# EAGLE board max10adc dpdt (EAGLE 8.4.3), part 1 of 2
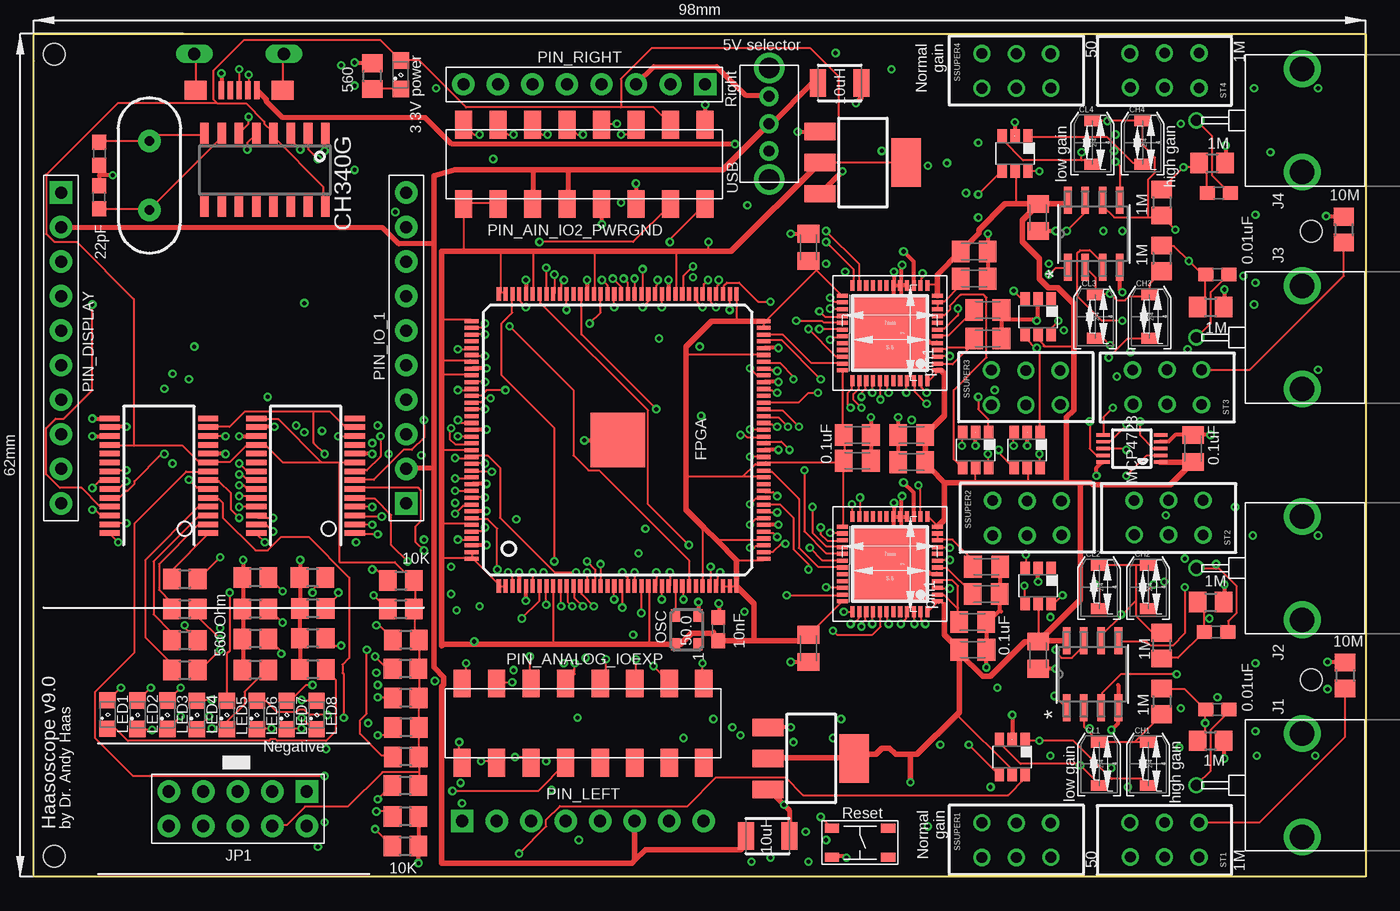
[diagram p2: board, top side]
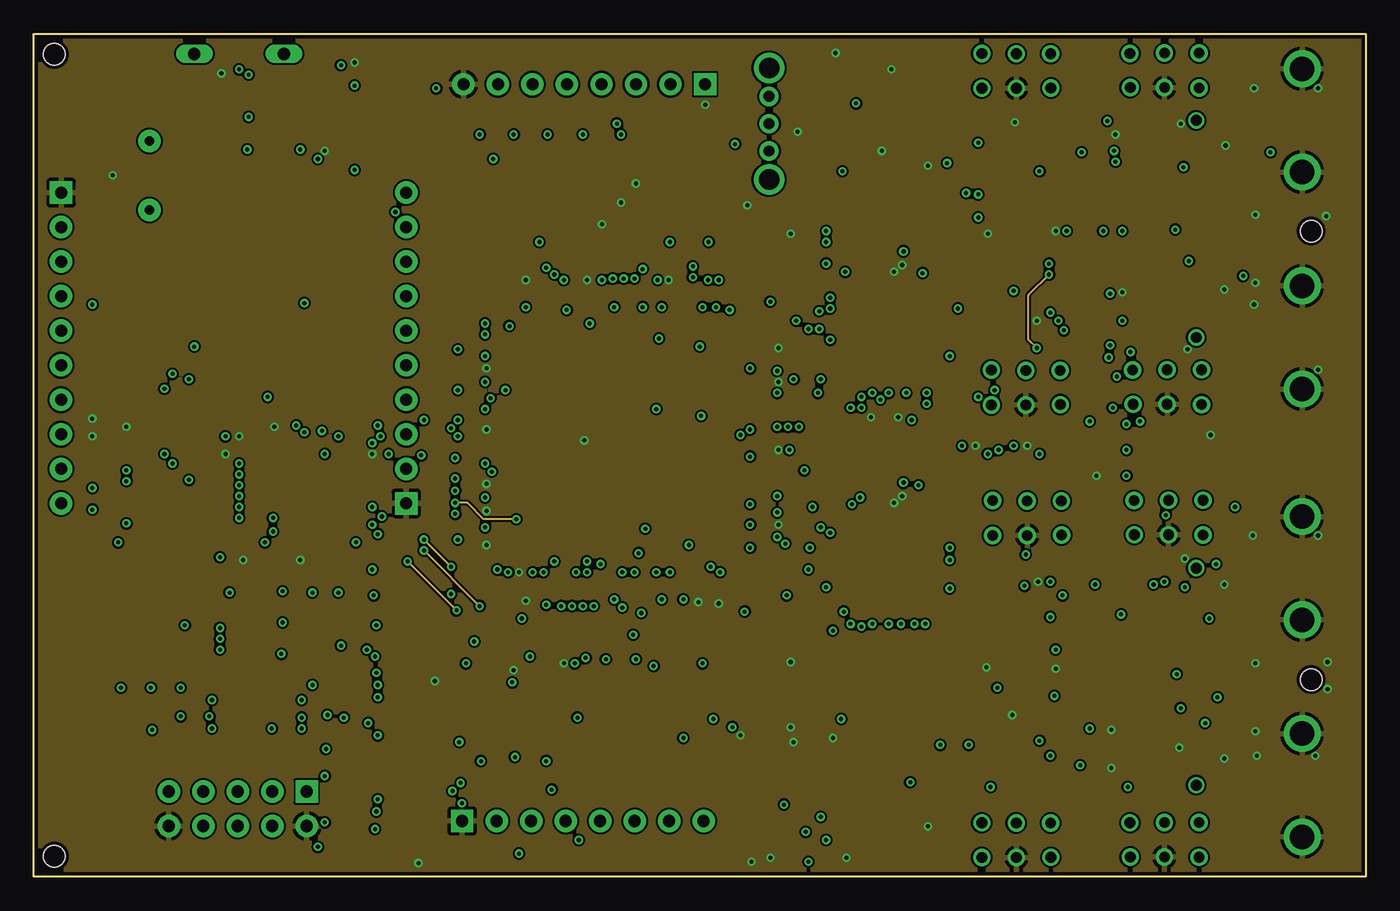
[diagram p3: board, inner layer Route2]
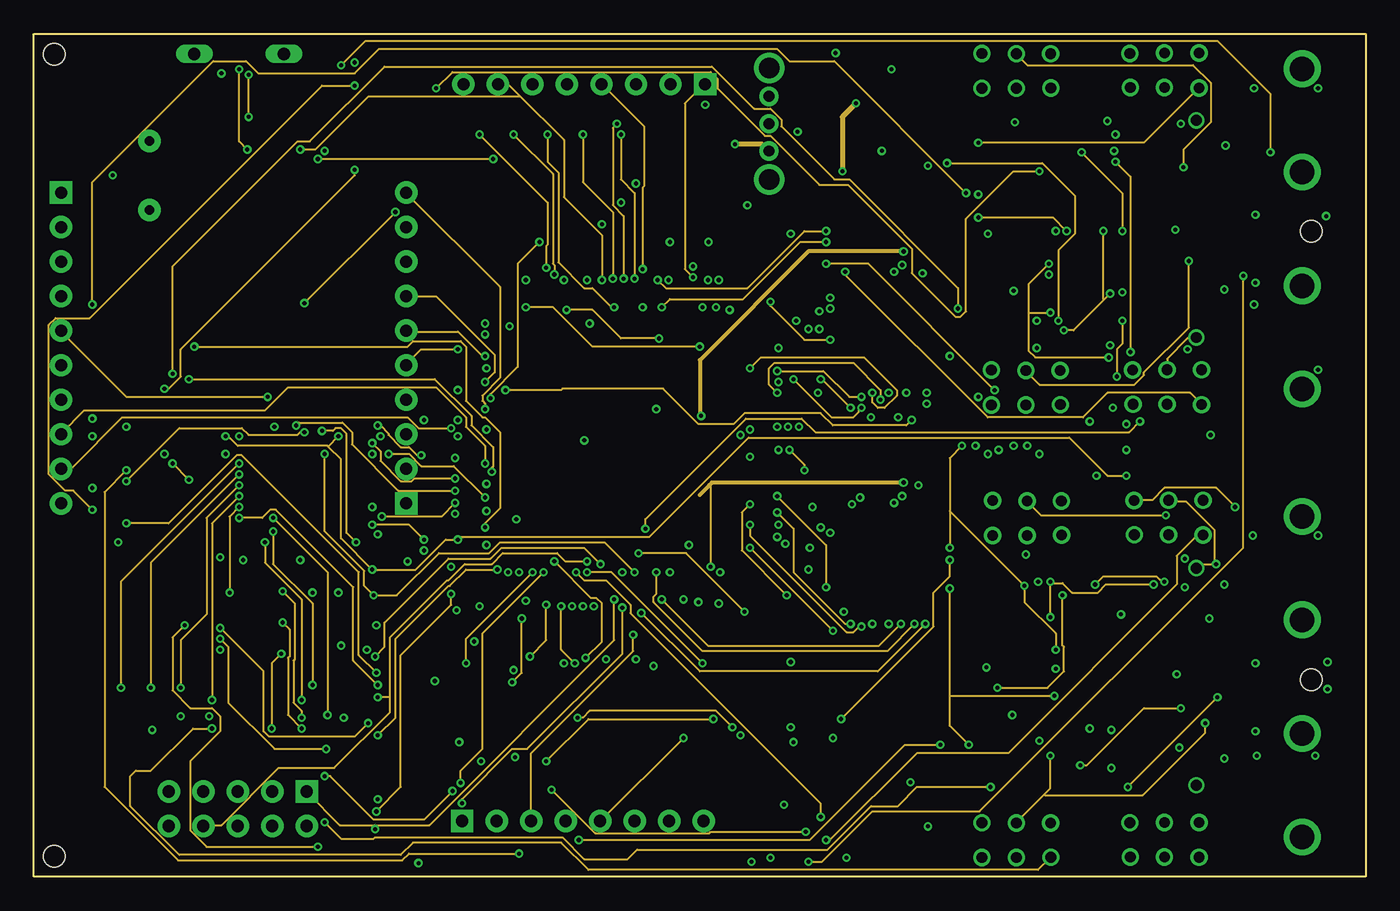
[diagram p4: board, inner layer Route15]
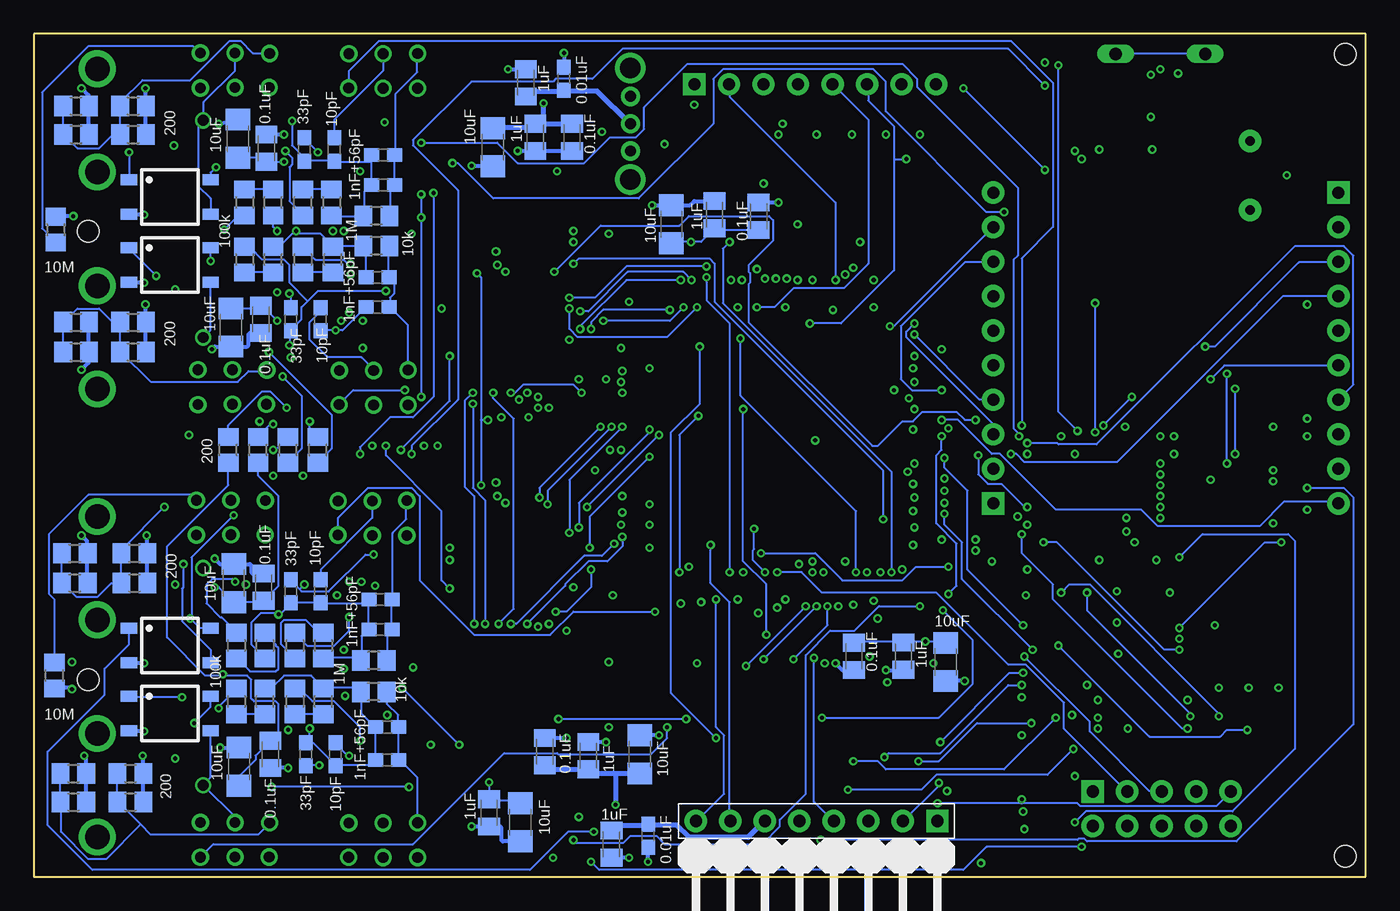
[diagram p5: board, bottom side, seen from below]

Size 98 x 62 mm. Coordinates in mm from the lower left corner, seen from the top.
Outline: 0,0 0,62 98,62 98,0 0,0
Copper layers (1*2*15*16): Top 0.035mm / dielectric 0.2mm / Route2 0.0175mm / dielectric 0.3mm / Route15 0.0175mm / dielectric 0.2mm / Bottom 0.035mm
Design rules "Seeed_AllPCB_MacroFab_haas6mil": minimum track width 6mil, minimum drill 12mil, track to track 6mil, track to pad 6mil, pad to pad 6mil, via to via 6mil, smd to smd 0mil, copper to edge 10mil, drill to drill 8mil, minimum pad ring 6mil, minimum via ring 6mil, stop-mask expansion 6mil, vias tented up to drill 25mil, thermal gap 10mil
Net classes: 0 default: width 0.152 mm; 1 gnd: width 0.305 mm; 2 three: width 0.152 mm; 3 five: width 0.381 mm
Holes 1.6 mm at 94,14.5 94,47.5 1.5,60.5 1.5,1.5

## Footprints (pad centres in the part's own frame; a part is rotated, then mirrored left to right if it is on the bottom)
R0805 = smd 1.3 x 1.5: 1 -0.95,0; 2 0.95,0
C0805K = smd 1.3 x 1.6: 1 -1,0; 2 1,0
C0603 = smd 1.1 x 1: 1 -0.85,0; 2 0.85,0
C1206 = smd 1.6 x 1.8: 1 -1.4,0; 2 1.4,0
CTZ3 = smd 1.2 x 0.8: + 0,1.598; - 0,-1.588
MSOP10 = smd 0.25 x 1: 1 -1,-2.113; 2 -0.5,-2.113; 3 0,-2.113; 4 0.5,-2.113; 5 1,-2.113; 6 1,2.113; 7 0.5,2.113; 8 0,2.113; 9 -0.5,2.113; 10 -1,2.113
EQFP144 = smd 1 x 0.3: 1 -10.75,8.75; 2 -10.75,8.25; 3 -10.75,7.75; 4 -10.75,7.25; 5 -10.75,6.75; 6 -10.75,6.25; 7 -10.75,5.75; 8 -10.75,5.25; 9 -10.75,4.75; 10 -10.75,4.25; 11 -10.75,3.75; 12 -10.75,3.25; 13 -10.75,2.75; 14 -10.75,2.25; 15 -10.75,1.75; 16 -10.75,1.25; 17 -10.75,0.75; 18 -10.75,0.25; 19 -10.75,-0.25; 20 -10.75,-0.75; 21 -10.75,-1.25; 22 -10.75,-1.75; 23 -10.75,-2.25; 24 -10.75,-2.75; 25 -10.75,-3.25; 26 -10.75,-3.75; 27 -10.75,-4.25; 28 -10.75,-4.75; 29 -10.75,-5.25; 30 -10.75,-5.75; 31 -10.75,-6.25; 32 -10.75,-6.75; 33 -10.75,-7.25; 34 -10.75,-7.75; 35 -10.75,-8.25; 36 -10.75,-8.75; 73 10.75,-8.75; 74 10.75,-8.25; 75 10.75,-7.75; 76 10.75,-7.25; 77 10.75,-6.75; 78 10.75,-6.25; 79 10.75,-5.75; 80 10.75,-5.25; 81 10.75,-4.75; 82 10.75,-4.25; 83 10.75,-3.75; 84 10.75,-3.25; 85 10.75,-2.75; 86 10.75,-2.25; 87 10.75,-1.75; 88 10.75,-1.25; 89 10.75,-0.75; 90 10.75,-0.25; 91 10.75,0.25; 92 10.75,0.75; 93 10.75,1.25; 94 10.75,1.75; 95 10.75,2.25; 96 10.75,2.75; 97 10.75,3.25; 98 10.75,3.75; 99 10.75,4.25; 100 10.75,4.75; 101 10.75,5.25; 102 10.75,5.75; 103 10.75,6.25; 104 10.75,6.75; 105 10.75,7.25; 106 10.75,7.75; 107 10.75,8.25; 108 10.75,8.75 | smd 0.3 x 1: 37 -8.75,-10.75; 38 -8.25,-10.75; 39 -7.75,-10.75; 40 -7.25,-10.75; 41 -6.75,-10.75; 42 -6.25,-10.75; 43 -5.75,-10.75; 44 -5.25,-10.75; 45 -4.75,-10.75; 46 -4.25,-10.75; 47 -3.75,-10.75; 48 -3.25,-10.75; 49 -2.75,-10.75; 50 -2.25,-10.75; 51 -1.75,-10.75; 52 -1.25,-10.75; 53 -0.75,-10.75; 54 -0.25,-10.75; 55 0.25,-10.75; 56 0.75,-10.75; 57 1.25,-10.75; 58 1.75,-10.75; 59 2.25,-10.75; 60 2.75,-10.75; 61 3.25,-10.75; 62 3.75,-10.75; 63 4.25,-10.75; 64 4.75,-10.75; 65 5.25,-10.75; 66 5.75,-10.75; 67 6.25,-10.75; 68 6.75,-10.75; 69 7.25,-10.75; 70 7.75,-10.75; 71 8.25,-10.75; 72 8.75,-10.75; 109 8.75,10.75; 110 8.25,10.75; 111 7.75,10.75; 112 7.25,10.75; 113 6.75,10.75; 114 6.25,10.75; 115 5.75,10.75; 116 5.25,10.75; 117 4.75,10.75; 118 4.25,10.75; 119 3.75,10.75; 120 3.25,10.75; 121 2.75,10.75; 122 2.25,10.75; 123 1.75,10.75; 124 1.25,10.75; 125 0.75,10.75; 126 0.25,10.75; 127 -0.25,10.75; 128 -0.75,10.75; 129 -1.25,10.75; 130 -1.75,10.75; 131 -2.25,10.75; 132 -2.75,10.75; 133 -3.25,10.75; 134 -3.75,10.75; 135 -4.25,10.75; 136 -4.75,10.75; 137 -5.25,10.75; 138 -5.75,10.75; 139 -6.25,10.75; 140 -6.75,10.75; 141 -7.25,10.75; 142 -7.75,10.75; 143 -8.25,10.75; 144 -8.75,10.75 | smd 4 x 4: E 0,0
DBV_R-PDSO-G6 = smd 0.69 x 0.99: 1 -0.95,-1.29; 2 0,-1.29; 3 0.95,-1.29; 4 0.95,1.3; 5 0,1.3; 6 -0.95,1.3
TQFP-48 = smd 0.8 x 0.3: 1 -3.5,2.75; 2 -3.5,2.25; 3 -3.5,1.75; 4 -3.5,1.25; 5 -3.5,0.75; 6 -3.5,0.25; 7 -3.5,-0.25; 8 -3.5,-0.75; 9 -3.5,-1.25; 10 -3.5,-1.75; 11 -3.5,-2.25; 12 -3.5,-2.75; 25 3.5,-2.75; 26 3.5,-2.25; 27 3.5,-1.75; 28 3.5,-1.25; 29 3.5,-0.75; 30 3.5,-0.25; 31 3.5,0.25; 32 3.5,0.75; 33 3.5,1.25; 34 3.5,1.75; 35 3.5,2.25; 36 3.5,2.75 | smd 0.3 x 0.8: 13 -2.75,-3.5; 14 -2.25,-3.5; 15 -1.75,-3.5; 16 -1.25,-3.5; 17 -0.75,-3.5; 18 -0.25,-3.5; 19 0.25,-3.5; 20 0.75,-3.5; 21 1.25,-3.5; 22 1.75,-3.5; 23 2.25,-3.5; 24 2.75,-3.5; 37 2.75,3.5; 38 2.25,3.5; 39 1.75,3.5; 40 1.25,3.5; 41 0.75,3.5; 42 0.25,3.5; 43 -0.25,3.5; 44 -0.75,3.5; 45 -1.25,3.5; 46 -1.75,3.5; 47 -2.25,3.5; 48 -2.75,3.5 | smd 5.588 x 5.588: EP_GND 0,0
SSOP28 = smd 0.4 x 1.5: 1 -4.225,-3.625; 2 -3.575,-3.625; 3 -2.925,-3.625; 4 -2.275,-3.625; 5 -1.625,-3.625; 6 -0.975,-3.625; 7 -0.325,-3.625; 8 0.325,-3.625; 9 0.975,-3.625; 10 1.625,-3.625; 11 2.275,-3.625; 12 2.925,-3.625; 13 3.575,-3.625; 14 4.225,-3.625; 15 4.225,3.625; 16 3.575,3.625; 17 2.925,3.625; 18 2.275,3.625; 19 1.625,3.625; 20 0.975,3.625; 21 0.325,3.625; 22 -0.325,3.625; 23 -0.975,3.625; 24 -1.625,3.625; 25 -2.275,3.625; 26 -2.925,3.625; 27 -3.575,3.625; 28 -4.225,3.625
MOLEX-BNC-73100-0105 = drill 1.8: GND1 -3.8,-3.9; GND2 3.8,-3.9 | drill 0.8: SIGNAL 0,3.9
H2X5-2.54 = drill 0.889 pad 1.651 square: 1 -1.27,5.08 | drill 0.889 pad 1.651: 2 -1.27,2.54; 3 -1.27,0; 4 -1.27,-2.54; 5 -1.27,-5.08; 6 1.27,-5.08; 7 1.27,-2.54; 8 1.27,0; 9 1.27,2.54; 10 1.27,5.08
SOP04 = smd 0.8 x 1.2: 1 -1.27,-3; 2 1.27,-3; 3 1.27,3; 4 -1.27,3
1210 = smd 1.2 x 2: 1 -1.6,0; 2 1.6,0
SML0805 = smd 1.2 x 1.2: A 1.05,0; C -1.05,0
ASE = smd 0.9 x 0.65: 1 -1.05,-0.825; 2 1.05,-0.825; 3 1.05,0.825; 4 -1.05,0.825
2X08_SMT = smd 1.27 x 2.032: 1 -8.89,-2.921; 2 -8.89,2.921; 3 -6.35,-2.921; 4 -6.35,2.921; 5 -3.81,-2.921; 6 -3.81,2.921; 7 -1.27,-2.921; 8 -1.27,2.921; 9 1.27,-2.921; 10 1.27,2.921; 11 3.81,-2.921; 12 3.81,2.921; 13 6.35,-2.921; 14 6.35,2.921; 15 8.89,-2.921; 16 8.89,2.921
H10-2.54 = drill 0.889 pad 1.651 square: 1 0,11.43 | drill 0.889 pad 1.651: 2 0,8.89; 3 0,6.35; 4 0,3.81; 5 0,1.27; 6 0,-1.27; 7 0,-3.81; 8 0,-6.35; 9 0,-8.89; 10 0,-11.43
H8-2.54-90D-MALE = drill 0.889 pad 1.651 square: 1 0,8.89 | drill 0.889 pad 1.651: 2 0,6.35; 3 0,3.81; 4 0,1.27; 5 0,-1.27; 6 0,-3.81; 7 0,-6.35; 8 0,-8.89
H8-2.54-90D-FEMALE = drill 0.889 pad 1.651 square: 1 0,8.89 | drill 0.889 pad 1.651: 2 0,6.35; 3 0,3.81; 4 0,1.27; 5 0,-1.27; 6 0,-3.81; 7 0,-6.35; 8 0,-8.89
SOT-223 = smd 1.27 x 2.286: 1 -2.286,-3.175; 2 0,-3.175; 3 2.286,-3.175 | smd 3.556 x 2.159: TER 0,3.175
OS = drill 0.787 pad 1.27: 1 -2.54,1.27; 2 0,1.295; 3 2.54,1.295; 4 -2.515,-1.245; 5 0,-1.245; 6 2.54,-1.27
0S102011MS2QS1 = drill 0.8 pad 1.422: 1 -2.007,0; 2 0,0; 3 2.007,0 | drill 1.5 pad 2.184: P$4 -4.102,0; P$5 4.102,0
TACT4.2MM = smd 1.05 x 0.65: P$1 -2.075,1.075; P$2 2.075,1.075; P$3 -2.075,-1.075; P$4 2.075,-1.075
M08A = smd 1.981 x 0.559: 1 -2.464,1.905; 2 -2.464,0.635; 3 -2.464,-0.635; 4 -2.464,-1.905; 5 2.464,-1.905; 6 2.464,-0.635; 7 2.464,0.635; 8 2.464,1.905
SOIC16 = smd 0.635 x 1.524: 1 -4.445,-2.695; 2 -3.175,-2.695; 3 -1.905,-2.695; 4 -0.635,-2.695; 5 0.635,-2.695; 6 1.905,-2.695; 7 3.175,-2.695; 8 4.445,-2.695; 9 4.445,2.695; 10 3.175,2.695; 11 1.905,2.695; 12 0.635,2.695; 13 -0.635,2.695; 14 -1.905,2.695; 15 -3.175,2.695; 16 -4.445,2.695
10118193-0001LF = smd 0.4 x 1.35: 1 -1.3,2.54; 2 -0.65,2.54; 3 0,2.54; 4 0.65,2.54; 5 1.3,2.54 | drill 0.9 long: S1 -3.3,-0.135; S2 3.3,-0.135 | smd 1.6 x 1.4: S3 -3.2,2.54; S4 3.2,2.54
HC49US = drill 0.7 pad 1.651: 1 -2.54,0; 2 2.54,0

## Placement (x,y rotation side)
ACR1  560  [R0805]  11.1,21.9 0 top
ACR2  560  [R0805]  11.1,19.7 0 top
ACR3  560  [R0805]  11.1,17.4 0 top
ACR4  560  [R0805]  11.1,15.2 0 top
C0DD1_A  0.1uF  [C0805K]  57,16.8 270 top
C0DD2_A  0.1uF  [C0805K]  60.6,30.6 0 top
C0DD2_B  0.1uF  [C0805K]  57,46.3 90 top
C5VOPAMP1  0.1uF  [C0805K]  73.9,16.3 270 top
C5VOPAMP2  0.1uF  [C0805K]  73.9,48.5 270 top
C-AIN1  0.1uF  [C0805K]  69.08,18.74 0 top
C-AIN2  0.1uF  [C0805K]  70.1,22.8 0 top
C-AIN3  0.1uF  [C0805K]  70.2,39.6 0 top
C-AIN4  0.1uF  [C0805K]  69.2,44 0 top
C_5V_10NF  0.01uF  [C0603]  59,58.7 270 bottom
C_5V_10NF1  0.01uF  [C0603]  52.8,3 90 bottom
C_AC1  0.01uF  [C0603]  87.1,12.3 0 top
C_AC2  0.01uF  [C0603]  87,18 0 top
C_AC3  0.01uF  [C0603]  87.1,44.3 0 top
C_AC4  0.01uF  [C0603]  87.2,50.3 0 top
C_OSC  0.01uF  [C0603]  50.36,18.22 90 top
C_OSC1  22pF  [C0603]  4.8,50 90 top
C_OSC2  22pF  [C0603]  4.8,53.2 270 top
CADD1_A  0.1uF  [C0805K]  69.1,16.7 0 top
CADD1_B  0.1uF  [C0805K]  64.6,32.5 180 top
CADD2_A  0.1uF  [C0805K]  64.6,30.5 180 top
CADD2_B  0.1uF  [C0805K]  69.2,46 0 top
CG13  1uF  [C0805K]  34.01,16.23 270 bottom
CG14  10uF  [C1206]  30.91,15.79 270 bottom
CG15  0.1uF  [C0805K]  37.65,16.21 270 bottom
CGAIN1_1  33pF  [C0603]  78,9 270 bottom
CGAIN1_2  33pF  [C0603]  79.1,21 90 bottom
CGAIN1_3  33pF  [C0603]  79.1,41 270 bottom
CGAIN1_4  33pF  [C0603]  78.1,53.5 90 bottom
CH1  3-10pF  [CTZ3]  82,8.3 0 top
CH2  3-10pF  [CTZ3]  82,21.3 0 top
CH3  3-10pF  [CTZ3]  82.1,41.2 0 top
CH4  3-10pF  [CTZ3]  81.6,54 0 top
CIN1NF_1  1nF  [C0603]  72,11 180 bottom
CIN1NF_2  1nF  [C0603]  72.5,18.2 180 bottom
CIN1NF_3  1nF  [C0603]  72.7,44.1 180 bottom
CIN1NF_4  1nF  [C0603]  72.3,50.9 180 bottom
CIN5_1  10pF  [C0603]  75.8,9 90 bottom
CIN5_2  10pF  [C0603]  76.9,21 90 bottom
CIN5_3  10pF  [C0603]  76.9,41 90 bottom
CIN5_4  10pF  [C0603]  75.9,53.5 90 bottom
CIN56_1  56pF  [C0603]  72,8.6 180 bottom
CIN56_2  56pF  [C0603]  72.5,20.4 180 bottom
CIN56_3  56pF  [C0603]  72.7,41.9 180 bottom
CIN56_4  56pF  [C0603]  72.3,53.1 180 bottom
CL1  8-45pF  [CTZ3]  78.4,8.3 0 top
CL2  8-45pF  [CTZ3]  78.4,21.3 0 top
CL3  8-45pF  [CTZ3]  78.1,41.2 0 top
CL4  8-45pF  [CTZ3]  77.9,54 0 top
CODD1_B  0.1uF  [C0805K]  60.6,32.5 0 top
COFFSET  0.1uF  [C0805K]  85.3,31.5 270 top
COFFSETA1  10uF  [C1206]  83.3,21.6 270 bottom
COFFSETA2  10uF  [C1206]  83.5,40.4 90 bottom
COFFSETA3  10uF  [C1206]  83,54.3 270 bottom
COFFSETA6  10uF  [C1206]  82.9,8.1 270 bottom
COFFSETB6  0.1uF  [C0805K]  80.6,9 90 bottom
COFFSETB8  0.1uF  [C0805K]  81.1,21.3 270 bottom
COFFSETB10  0.1uF  [C0805K]  81.3,41 90 bottom
COFFSETB12  0.1uF  [C0805K]  80.9,53.6 270 bottom
CP1  1uF  [C0805K]  61.1,54.4 270 bottom
CP2  0.1uF  [C0805K]  58.4,54.4 270 bottom
CP3  10uF  [C1206]  53.4,9 90 bottom
CP4  10uF  [C1206]  62.2,4 270 bottom
CP5  10uF  [C1206]  64.22,53.67 270 bottom
CP6  10uF  [C1206]  51.08,48 90 bottom
CP7  1uF  [C0805K]  57.2,8.9 90 bottom
CP8  0.1uF  [C0805K]  60.4,9.2 90 bottom
CP9  1uF  [C0805K]  64.5,4.7 270 bottom
CP10  1uF  [C0805K]  55.5,2.4 90 bottom
CP11  1uF  [C0805K]  61.8,58.4 270 bottom
CREF1  0.1uF  [C0805K]  70.08,20.8 0 top
CREF2  0.1uF  [C0805K]  70.2,41.7 0 top
CV11  0.1uF  [C0805K]  44.67,48.59 90 bottom
CV12  1uF  [C0805K]  47.91,48.71 90 bottom
DAC1  MCP4728  [MSOP10]  80.8,31.5 90 top
FPGA  10M08SAE144  [EQFP144]  42.96,32.13 90 top
GAINSW1  741G3157DBVR  [DBV_R-PDSO-G6]  72,8.8 180 top
GAINSW2  741G3157DBVR  [DBV_R-PDSO-G6]  73.9,21.4 180 top
GAINSW3  741G3157DBVR  [DBV_R-PDSO-G6]  73.9,41.2 180 top
GAINSW4  741G3157DBVR  [DBV_R-PDSO-G6]  72.2,53.2 180 top
IC1  MAX19506  [TQFP-48]  63,23 180 top
IC2  MAX19506  [TQFP-48]  63,40 180 top
IOEXPAND_0X20_BOT  MCP23017SS  [SSOP28]  9.2,29.5 90 top
IOEXPAND_0X24_TOP  MCP23017SS  [SSOP28]  20,29.5 90 top
J1  MOLEX_BNC_73100-0105  [MOLEX-BNC-73100-0105]  89.44,6.73 90 top
J2  MOLEX_BNC_73100-0105  [MOLEX-BNC-73100-0105]  89.44,22.7 90 top
J3  MOLEX_BNC_73100-0105  [MOLEX-BNC-73100-0105]  89.44,39.67 90 top
J4  MOLEX_BNC_73100-0105  [MOLEX-BNC-73100-0105]  89.44,55.64 90 top
JP1  2x5p-2.54  [H2X5-2.54]  15,5 270 top
K1  AQY21SOP  [SOP04]  88,12 270 bottom
K2  AQY21SOP  [SOP04]  88,17 270 bottom
K3  AQY21SOP  [SOP04]  88,45 270 bottom
K4  AQY21SOP  [SOP04]  88,50 270 bottom
L1  10uH  [1210]  59.3,58.4 0 top
L2  10uH  [1210]  54,3 0 top
LED1  MF-LED-0805-RED  [SML0805]  5.42,11.93 90 top
LED2  MF-LED-0805-RED  [SML0805]  7.62,11.92 90 top
LED3  MF-LED-0805-RED  [SML0805]  9.82,11.91 90 top
LED4  MF-LED-0805-RED  [SML0805]  12,11.9 90 top
LED5  MF-LED-0805-RED  [SML0805]  14.2,11.9 90 top
LED6  MF-LED-0805-RED  [SML0805]  16.4,11.9 90 top
LED7  MF-LED-0805-RED  [SML0805]  18.6,11.9 90 top
LED8  MF-LED-0805-RED  [SML0805]  20.8,11.9 90 top
LEDPOW  MF-LED-0805-RED  [SML0805]  27,59 90 top
OSC  ASE-50.000MHZ-ET  [ASE]  48.04,18.16 90 top
OVSAMP1  741G3157DBVR  [DBV_R-PDSO-G6]  73.1,31.4 180 top
OVSAMP2  741G3157DBVR  [DBV_R-PDSO-G6]  69.3,31.4 180 top
PIN_AIN_IO2_PWRGND  15-91-2160  [2X08_SMT]  40.5,52.4 180 top
PIN_ANALOG_IOEXP  15-91-2160  [2X08_SMT]  40.4,11.3 0 top
PIN_DISPLAY  YELLOW-10P-2.54  [H10-2.54]  2,38.9 0 top
PIN_IO_1  YELLOW-10P-2.54  [H10-2.54]  27.4,38.9 180 top
PIN_LEFT  8p-2.54-90d  [H8-2.54-90D-MALE]  40.4,4.1 270 bottom
PIN_RIGHT  8p-2.54-90d  [H8-2.54-90D-FEMALE]  40.5,58.3 270 top
R10M_1  10M  [R0805]  96.5,14.8 270 top
R10M_2  10M  [R0805]  96.5,14.8 90 bottom
R10M_3  10M  [R0805]  96.4,47.6 270 top
R10M_4  10M  [R0805]  96.4,47.6 270 bottom
R50-1  200  [R0805]  90.9,5.5 0 bottom
R50-2  200  [R0805]  90.9,7.6 0 bottom
R50-3  200  [R0805]  95.1,7.6 0 bottom
R50-4  200  [R0805]  95.1,5.5 0 bottom
R50-5  200  [R0805]  90.6,21.6 0 bottom
R50-6  200  [R0805]  95,23.8 0 bottom
R50-7  200  [R0805]  90.6,23.8 0 bottom
R50-8  200  [R0805]  95,21.6 0 bottom
R50-9  200  [R0805]  90.7,38.6 0 bottom
R50-10  200  [R0805]  94.9,38.6 0 bottom
R50-11  200  [R0805]  94.9,40.8 0 bottom
R50-12  200  [R0805]  90.7,40.8 0 bottom
R50-13  200  [R0805]  90.7,56.7 0 bottom
R50-14  200  [R0805]  90.7,54.6 0 bottom
R50-15  200  [R0805]  94.9,54.6 0 bottom
R50-16  200  [R0805]  94.9,56.7 0 bottom
R_SCL  10K  [R0805]  27,21.8 0 top
R_SDA  10K  [R0805]  27,19.7 0 top
REG  LDL1117S33R  [SOT-223]  61.01,52.54 270 top
REG1  LDL1117S33R  [SOT-223]  57.2,8.7 270 top
RGAIN1_1  100k  [R0805]  81,12.9 90 bottom
RGAIN1_2  100k  [R0805]  81,17 270 bottom
RGAIN1_3  100k  [R0805]  80.4,45.4 90 bottom
RGAIN1_4  100k  [R0805]  82.5,49.6 270 bottom
RGAIN2_1  1M  [R0805]  76.7,12.9 90 bottom
RGAIN2_2  1M  [R0805]  76.7,17 270 bottom
RGAIN2_3  1M  [R0805]  76,45.4 90 bottom
RGAIN2_4  1M  [R0805]  76.1,49.6 270 bottom
RGAIN3_1  100k  [R0805]  83.1,12.9 270 bottom
RGAIN3_2  100k  [R0805]  83.1,17 270 bottom
RGAIN3_3  100k  [R0805]  82.5,45.4 270 bottom
RGAIN3_4  100k  [R0805]  80.4,49.6 90 bottom
RGAIN4_1  1M  [R0805]  78.8,12.9 270 bottom
RGAIN4_2  1M  [R0805]  78.8,17 270 bottom
RGAIN4_3  1M  [R0805]  78.2,45.4 270 bottom
RGAIN4_4  1M  [R0805]  78.2,49.6 90 bottom
RIN1  1M  [R0805]  83,12.9 270 top
RIN1_10K  10K  [R0805]  73,13.6 180 bottom
RIN2  1M  [R0805]  83,17 90 top
RIN2_10K  10K  [R0805]  73,15.9 180 bottom
RIN3  1M  [R0805]  83,45.5 270 top
RIN3_10K  10K  [R0805]  72.8,46.4 180 bottom
RIN4  1M  [R0805]  83,49.6 270 top
RIN4_10K  10K  [R0805]  72.8,48.6 180 bottom
RIN5  1M  [R0805]  86.6,10 0 top
RIN6  1M  [R0805]  86.6,20.2 0 top
RIN7  1M  [R0805]  86.6,41.9 0 top
RIN8  1M  [R0805]  86.7,52.5 0 top
RJ2  10K  [R0805]  27.33,2.26 0 top
RJ3  10K  [R0805]  27.34,15.3 180 top
RJ4  10K  [R0805]  27.33,6.7 180 top
RJ5  10K  [R0805]  27.36,13.14 180 top
RLED1  560  [R0805]  20.53,15.24 180 top
RLED2  560  [R0805]  20.52,17.54 180 top
RLED3  560  [R0805]  20.51,19.74 180 top
RLED4  560  [R0805]  20.5,22 180 top
RLED5  560  [R0805]  16.3,15.2 180 top
RLED6  560  [R0805]  16.3,17.5 180 top
RLED7  560  [R0805]  16.3,19.7 180 top
RLED8  560  [R0805]  16.3,22 180 top
RLEDPOW  560  [R0805]  24.9,58.9 90 top
ROFFSET1  200  [R0805]  83.7,31.4 90 bottom
ROFFSET2  200  [R0805]  81.5,31.4 90 bottom
ROFFSET3  200  [R0805]  79.3,31.4 90 bottom
ROFFSET4  200  [R0805]  77.1,31.4 90 bottom
RS6  10K  [R0805]  27.34,4.42 180 top
RS7  10K  [R0805]  27.37,10.98 180 top
RS8  10K  [R0805]  27.36,8.82 180 top
RS9  10K  [R0805]  27.37,17.42 180 top
SSUPER1  dpdt  [OS]  72.3,2.7 180 top
SSUPER2  dpdt  [OS]  73.1,26.4 180 top
SSUPER3  dpdt  [OS]  73,36 180 top
SSUPER4  dpdt  [OS]  72.3,59.3 180 top
ST1  dpdt  [OS]  83.2,2.7 0 top
ST2  dpdt  [OS]  83.5,26.4 0 top
ST3  dpdt  [OS]  83.4,36 0 top
ST4  dpdt  [OS]  83.2,59.3 0 top
SW_5V  OS102011MS2QN1  [0S102011MS2QS1]  54.1,55.4 90 top
SW_RESET  MF-SW-TACT-4.2MM  [TACT4.2MM]  60.8,2.5 180 top
U1  MAX4416ESA  [M08A]  77.9,14.9 90 top
U2  MAX4416ESA  [M08A]  78,47.3 90 top
U340G  CH340G  [SOIC16]  17,52 180 top
USB1  MF-CON-MICROUSB-RIGHT  [10118193-0001LF]  15.1,60.4 180 top
Y1  ABL-12.000MHZ-B2  [HC49US]  8.5,51.6 90 top

## Tracks (layer width: path | path; a pad name or v marks a point on that pad's centre or on a via)
5VINFROMRIGHT
  Top 0.381: SW_5V.3 54,57.5 52.35,57.5 50.25,59.6 45.6,59.6 44.4,58.4 PIN_RIGHT.3
5VINFROMUSB  (via drill 0.3)
  Top 0.381: v51.6,53.9 30.75,53.9 28.8,55.85 18.3,55.85 17.1,57.05 17.1,57.2 16.5,57.8 USB1.1
  Route15 0.381: v51.6,53.9 53.55,53.9 54,53.45 SW_5V.1
+3V3  (via drill 0.3)
  Top 0.152: 16.35,33.8 IOEXPAND_0X24_TOP.15 16.5,33.65 18,33.65 21.15,30.5 | 7.35,31.7 10.95,31.7 12.15,30.5 12.75,30.5 IOEXPAND_0X20_BOT.9 12.9,30.5 14.4,30.5 15.6,31.7 16.35,31.7 IOEXPAND_0X24_TOP.18 16.5,31.7 17.1,31.7 18.3,30.5 21.15,30.5 | 7.35,31.7 5.7,31.7 IOEXPAND_0X20_BOT.18 | 21.15,30.5 22.5,30.5 | 22.5,30.5 23.55,30.5 IOEXPAND_0X24_TOP.9 | 28.35,7.7 28.35,8.75 RS8.1 28.35,8.9 28.35,10.85 RS7.1 28.35,11 28.35,13.1 RJ5.1 28.35,13.25 28.35,15.2 RJ3.1 28.35,15.35 28.35,17.3 RS9.1 28.2,17.45 28.05,17.6 28.05,19.7 | 28.35,7.7 28.35,6.8 RJ4.1 | 28.35,7.7 25.65,7.7 23.1,5.15 19.95,5.15 18.6,3.8 17.55,3.8 JP1.9 | 22.5,30.5 22.5,23.15 26.55,23.15 27.9,21.8 R_SCL.2 28.05,21.8 28.05,19.7 | U340G.16 21.3,49.4 21.3,50.75 17.7,54.35 17.7,54.65 U340G.4 17.55,54.8 16.95,55.4 16.95,55.55 15.6,56.9 13.5,56.9 | 43.2,56.6 45.6,56.6 46.8,55.4 PIN_AIN_IO2_PWRGND.3 | 43.2,56.6 31.8,56.6 28.35,60.05 LEDPOW.A 25.5,61.55 15.45,61.55 13.2,59.3 13.2,57.2 13.5,56.9 | IC2.36 59.55,37.25 59.55,32.6 CODD1_B.1 59.7,32.45 59.7,30.65 C0DD2_A.1 59.55,30.5 | 59.55,30.5 59.55,25.85 IC1.25 | 57.6,44.6 57,45.2 C0DD2_B.1 | 57.6,44.6 59.4,42.8 IC2.25 | PIN_AIN_IO2_PWRGND.14 34.05,49.55 31.65,49.55 PIN_AIN_IO2_PWRGND.16 31.65,49.4 31.65,46 | FPGA.34 50.85,21.35 51.15,21.35 FPGA.35 51.3,21.35 51.6,21.35 FPGA.36 | 34.35,42.95 34.65,42.95 FPGA.107 | FPGA.2 34.65,21.35 34.35,21.35 FPGA.1 34.2,21.5 32.25,23.45 | 32.25,23.45 32.25,23.75 FPGA.143 | IC1.36 57.15,17.9 C0DD1_A.1 | 30,26 32.1,26 FPGA.139 | 38.25,17.11 38.25,21.35 FPGA.9 | 30,31.4 32.1,31.4 FPGA.128 | 30,36.95 32.1,36.95 FPGA.117 | 45.3,17.11 45.3,21.35 FPGA.23
  Top 0.152: 30,38 32.1,38 FPGA.115 | FPGA.31 49.2,21.5 49.2,25.55 49.33,25.68 | 30,41 32.1,41 FPGA.109 | FPGA.37 53.7,23.3 51.9,23.3 51.71,23.29 | 36.75,46 36.75,42.95 FPGA.103 | 41.25,46 41.25,42.95 FPGA.94 | 47.25,46 47.25,42.95 FPGA.82 | 51.75,40.88 51.75,42.8 FPGA.73 | FPGA.40 53.7,24.8 50.4,24.8 50.3,24.7 | 48,29.45 52.2,29.45 | 52.2,29.45 53.7,29.45 FPGA.49 | 52.2,29.45 53.1,30.35 53.7,30.35 FPGA.51 53.85,30.5 59.55,30.5 | 48,38.45 53.7,38.45 FPGA.67 | FPGA.72 53.7,40.4 FPGA.71 | 30,23.45 32.1,23.45 FPGA.144 32.25,23.45 | 34.35,46 34.35,42.95 | 34.35,42.95 FPGA.108 | 57.6,44.6 53.85,40.85 FPGA.72 | 59.25,52.55 57.9,52.55 REG.2 | 59.25,52.55 64.05,52.55 REG.TER | v32.4,17.3 32.4,17.11 | 49.65,46 v49.65,46.7 | 43.2,56.6 43.2,58.7 45.45,60.95 57.15,60.95 59.25,58.85 59.25,52.55 | 13.5,56.9 6.15,56.9 0.9,51.65 0.9,47.3 1.5,46.7 3.15,46.7 7.35,42.5 7.35,31.7 | 28.05,19.7 R_SDA.2
  Top 0.406: REG.2 51.3,46 49.65,46 47.25,46 41.25,46 36.75,46 34.35,46 31.65,46 30,46 30,41 30,38 30,36.95 30,31.4 30,26 30,23.45 30,17 30.11,17.11 32.4,17.11 38.25,17.11 45.3,17.11 OSC.4 47.59,17.11 48.39,17.92 49.92,17.92 50,18 50,17.73 C_OSC.1 53,17.37 | 53,17.37 56.57,17.37 C0DD1_A.1 | 53,17.37 53,20.09 FPGA.36 51.71,23.29 50.3,24.7 49.33,25.68 48,27 48,29.45 48,38.45 48,39 49.88,40.88 51.75,40.88 FPGA.72
  Bottom 0.152: CV11.1 44.7,47.6 47.85,47.6 CV12.1 48,47.6 48.9,46.7 v49.65,46.7 51,46.7 CP6.1 | CG14.1 31.05,17.3 v32.4,17.3 33.9,17.3 CG13.1 34.05,17.3 37.65,17.3 CG15.1
+5V
  Top 0.381: L1.1 57.3,58.4 54.3,55.4 SW_5V.2 | 36.75,52 36.75,49.55 PIN_AIN_IO2_PWRGND.12 | 39.3,52 39.3,49.55 PIN_AIN_IO2_PWRGND.10 | 29.44,46.55 26.85,46.55 25.65,47.75 2.1,47.75 PIN_DISPLAY.2 | 29.44,30.05 27.45,30.05 PIN_IO_1.2
  Top 0.406: SW_5V.2 50.7,52 39.3,52 36.75,52 31,52 29.44,51.56 29.44,46.55 29.44,30.05 29.44,15.39 30.16,14.67 30.16,14.13 30,13.97 30,1 44,1 44.21,1.21 | 44.21,1.21 PIN_LEFT.6 | 44.21,1.21 45,2 52,2 52.4,2.4 L2.1
  Bottom 0.381: CP11.2 61.8,57.5 61.5,57.8 59.1,57.8 C_5V_10NF.2 58.95,57.8 56.55,57.8 54.15,55.4 SW_5V.2 | CP10.2 55.5,3.5 55.2,3.8 52.8,3.8 C_5V_10NF1.2 52.65,3.8 50.7,3.8 49.8,2.9 45.45,2.9 44.25,4.1 PIN_LEFT.6
A6  (via drill 0.3)
  Top 0.152: v36.7,22.4 36.7,21.4 FPGA.6 | v31.8,15.7 31.8,14.5 31.6,14.3 PIN_ANALOG_IOEXP.2
  Route15 0.152: v36.7,22.4 31.8,17.5 v31.8,15.7
A7  (via drill 0.3)
  Top 0.152: v35.9,19 37.2,20.3 37.2,21.3 FPGA.7 | v35.2,14.3 34.1,14.3 PIN_ANALOG_IOEXP.4
  Route15 0.152: v35.9,19 35.9,15 v35.2,14.3
A8  (via drill 0.3)
  Top 0.152: v37.7,20 37.7,21.3 FPGA.8 | v36.5,16.2 36.5,14.3 PIN_ANALOG_IOEXP.6
  Route15 0.152: v37.7,20 37.7,17.4 v36.5,16.2
A10  (via drill 0.3)
  Top 0.152: v38.8,19.9 38.8,21.3 FPGA.10 | v39.8,15.7 39.8,14.9 39.2,14.3 PIN_ANALOG_IOEXP.8
  Route15 0.152: v38.8,19.9 38.8,16.7 v39.8,15.7
A11  (via drill 0.3)
  Top 0.152: v39.6,19.9 39.3,20.2 39.3,21.3 FPGA.11 | v42.1,16 42.1,14.7 41.7,14.3 PIN_ANALOG_IOEXP.10
  Bottom 0.152: v39.6,19.9 39.6,18.5 v42.1,16
A12  (via drill 0.3)
  Top 0.152: v40.4,19.9 39.8,20.5 39.8,21.3 FPGA.12 | v44.3,16 44.3,14.3 PIN_ANALOG_IOEXP.12
  Bottom 0.152: v44.3,16 v40.4,19.9
A13  (via drill 0.3)
  Top 0.152: v41.2,19.9 40.3,20.8 40.3,21.3 FPGA.13 | v45.6,15.5 46.8,14.3 PIN_ANALOG_IOEXP.14
  Bottom 0.152: v45.6,15.5 v41.2,19.9
A14  (via drill 0.3)
  Top 0.152: v40.7,22.4 40.7,21.4 FPGA.14 | v49.2,15.7 49.2,14.3 PIN_ANALOG_IOEXP.16
  Route15 0.152: v40.7,22.4 42.5,22.4 v49.2,15.7
AIN1  (via drill 0.3)
  Top 0.152: v34.9,22.4 35.2,22.1 35.2,21.4 FPGA.3 | v46.8,46.7 46.8,46.9 49.3,49.4 PIN_AIN_IO2_PWRGND.2
  Bottom 0.152: v34.9,22.4 34.9,29.8 47.3,42.2 47.3,46.2 v46.8,46.7
CGAIN1  (via drill 0.3)
  Top 0.152: GAINSW1.3 71.1,10 71.1,9.8 72.6,8.3 76.9,8.3 v77,8.2 78.4,6.8 CL1.-
  Route15 0.152: v84.4,12.4 81.7,12.4 77.5,8.2 v77,8.2
  Bottom 0.152: v77,8.2 78,8.2 CGAIN1_1.2 | v84.4,12.4 84.4,12.5 83.1,13.8 RGAIN3_1.1
CGAIN2  (via drill 0.3)
  Top 0.152: GAINSW1.1 73,10 v74,10 76.5,10 79.3,7.2 81.6,7.2 82,6.8 CH1.-
  Bottom 0.152: v74,10 74,11 75.9,12.9 77.5,12.9 78.4,13.8 78.8,13.8 RGAIN4_1.1
CGAIN3  (via drill 0.3)
  Top 0.152: v73,23.7 73,22.7 GAINSW2.3 | CL2.- 78.4,21.2 v78.1,21.5
  Route15 0.152: v83.2,21.7 83,21.7 82.6,22.1 78.7,22.1 v78.1,21.5
  Bottom 0.152: v73,23.7 73.6,23.7 76.3,21 78.3,21 78.45,21.15 | 78.45,21.15 79.1,21.8 CGAIN1_2.2 | 78.45,21.15 v78.1,21.5 | v83.2,21.7 83.4,21.9 84.9,21.9 85.3,21.5 85.3,20.1 84.3,19.1 84.2,19.1 83.1,18 RGAIN3_2.1
CGAIN4  (via drill 0.3)
  Top 0.152: v74.8,21.7 74.8,22.6 GAINSW2.1 | CH2.- 82,21.1 v82.4,21.5
  Route15 0.152: v74.8,19.1 74.8,21.6 | v82.4,21.5 78.9,21.5 78.3,20.9 76.4,20.9 75.7,21.6 74.8,21.6 | 74.8,21.6 v74.8,21.7
  Bottom 0.152: v74.8,19.1 74.8,18.1 75.9,17 77.9,17 78.8,17.9 RGAIN4_2.1
CGAIN5  (via drill 0.3)
  Top 0.152: v72.1,43.1 72.7,42.5 72.9,42.5 GAINSW3.3 | v79.2,39.1 78.7,39.6 CL3.-
  Bottom 0.152: v72.1,43.1 77.1,43.1 77.85,42.35 | 77.85,42.35 78.3,41.9 78.3,41 79.1,40.2 CGAIN1_3.2 79.1,40.1 79.2,40 v79.2,39.1 | 77.85,42.35 79.2,43.7 79.2,45 79.6,45.4 81.2,45.4 82.1,46.3 82.5,46.3 RGAIN3_3.1
CGAIN6  (via drill 0.3)
  Top 0.152: v79.1,38.2 80.5,39.6 CH3.- | v74.8,41.5 74.8,42.4 GAINSW3.1
  Route15 0.152: v79.1,38.2 73.7,38.2 73.2,38.7 73.2,41.5 | 73.2,41.5 73.2,43.6 v74.7,45.1 | 73.2,41.5 v74.8,41.5
  Bottom 0.152: v74.7,45.1 74.9,45.1 75.2,45.4 77.3,45.4 78.2,46.3 RGAIN4_3.1
CGAIN7  (via drill 0.3)
  Top 0.152: 77.1,52.7 77.7,52.7 77.9,52.5 CL4.- | 77.1,52.7 72.8,52.7 71.3,54.2 71.3,54.4 GAINSW4.3 | 77.1,52.7 v77.1,53.3
  Route15 0.152: v80.1,47.5 80.1,50.3 v77.1,53.3
  Bottom 0.152: v77.1,53.3 78.1,54.3 CGAIN1_4.2 | RGAIN3_4.1 80.4,47.8 v80.1,47.5
CGAIN8  (via drill 0.3)
  Top 0.152: 79.75,53.65 80.9,52.5 81.6,52.5 CH4.- | 79.75,53.65 79,54.4 73.2,54.4 GAINSW4.1 | 79.75,53.65 v79.5,53.4
  Bottom 0.152: v79.5,53.4 79,52.9 79,52.4 79.2,52.2 79.2,49.7 78.2,48.7 RGAIN4_4.1
CLKINFROMRIGHT_26  (via drill 0.3)
  Top 0.152: v46.8,22.4 46.8,21.4 FPGA.26
  Route15 0.152: v48.5,44.1 47.9,44.7 47.9,56.9 49.3,58.3 PIN_RIGHT.1
  Bottom 0.152: v46.8,22.4 46.8,40.7 48.5,42.4 v48.5,44.1
CLKOUT_32  (via drill 0.3, 0.35)
  Top 0.152: v49.8,22.8 49.8,21.4 FPGA.32
  Top 0.305: IC1.15 64.75,28.25 v64,29
  Route15 0.152: v49.8,22.8 49.8,28.7 49.7,28.8
  Route15 0.305: 49,28.1 49.7,28.8 49.9,29 v64,29
CLKOUT_33  (via drill 0.3, 0.35)
  Top 0.152: v50.5,22.4 50.3,22.2 50.3,21.4 FPGA.33
  Top 0.305: IC2.15 64.75,45.25 v64,46
  Route15 0.152: v49.1,33.9 49,34
  Route15 0.305: v64,46 57,46 49,38 49,34
  Bottom 0.152: v50.5,22.4 50.5,32.5 v49.1,33.9
CLKOUTTOLEFT_28  (via drill 0.3)
  Top 0.152: v47.8,20.4 47.8,21.3 FPGA.28
  Bottom 0.152: v47.8,20.4 47.8,11 47.2,10.4 47.2,6.1 49.2,4.1 PIN_LEFT.8
CONF  (via drill 0.3)
  Top 0.152: v34.1,22.6 34.1,25.6 33.4,26.3 32.3,26.3 FPGA.138 | v25.3,10.4 25.9,10.4 26.4,10.9 RS7.2
  Route15 0.152: v34.1,22.6 31.8,22.6 30.6,21.4 30.5,21.4 26.6,17.5 26.6,11.7 v25.3,10.4
CONFIG_SEL  (via drill 0.3)
  Top 0.152: v31.2,32.4 32.2,32.4 FPGA.126 | v25.2,4.8 26,4.8 26.3,4.5 RS6.2
  Route15 0.152: v30.7,20.8 30.7,20 27,16.3 27,6.6 v25.2,4.8
  Bottom 0.152: v31.2,32.4 31.2,31.4 31.6,31 31.6,26 30.1,24.5 30.1,21.4 v30.7,20.8
D0A  (via drill 0.3)
  Top 0.152: v58.3,21.3 59.5,21.3 IC1.34 | v54.7,28 54.4,28.3 53.8,28.3 FPGA.47
  Route15 0.152: v58.3,21.3 58.3,24.4 v54.7,28
D0B  (via drill 0.3)
  Top 0.152: v60.8,27.9 60.8,26.5 IC1.23 | v56.3,33.1 55.1,34.3 53.8,34.3 FPGA.59
  Bottom 0.152: v60.8,27.9 60.8,28.6 v56.3,33.1
D0C  (via drill 0.3)
  Top 0.152: v57,40.3 59,38.3 59.5,38.3 IC2.34 | v51.2,41.7 51.2,42.8 FPGA.74
  Bottom 0.152: v57,40.3 57,40.8 56.1,41.7 v51.2,41.7
D0D  (via drill 0.3)
  Top 0.152: v58.3,47.5 60.7,45.1 60.7,43.5 IC2.23 | v45.9,43.9 45.9,43.6 45.8,43.5 45.8,42.9 FPGA.85
  Route15 0.152: v58.3,47.5 56.7,47.5 52.5,43.3 46.5,43.3 v45.9,43.9
D1A  (via drill 0.3)
  Top 0.152: v55.4,20.7 59.5,20.7 IC1.35 | v52.7,27.4 53.1,27.8 53.7,27.8 FPGA.46
  Route15 0.152: v55.4,20.7 52.1,24 52.1,26.8 v52.7,27.4
D1B  (via drill 0.3)
  Top 0.152: v60.2,27.4 60.2,26.5 IC1.24 | v55.5,33.1 54.8,33.8 53.8,33.8 FPGA.58
  Bottom 0.152: v60.2,27.4 60.2,28.4 v55.5,33.1
D1C
  Top 0.152: IC2.35 59.5,37.8 57.2,37.8 55.1,39.9 53.8,39.9 FPGA.70
D1D  (via drill 0.3)
  Top 0.152: v58.3,46.7 60.3,44.7 60.3,43.5 IC2.24 | v46.2,41.9 46.2,42.8 FPGA.84
  Route15 0.152: v58.3,46.7 56.4,46.7 52.2,42.5 46.8,42.5 v46.2,41.9
D2A  (via drill 0.3)
  Top 0.152: v59.6,19.5 IC1.37 | v57,22.6 57,23 55.9,24.1 55.9,26.4 54.9,27.4 53.8,27.4 FPGA.45
  Bottom 0.152: v59.6,19.5 58.8,19.5 57,21.3 v57,22.6
D2B  (via drill 0.3)
  Top 0.152: v58.6,25.3 59.5,25.3 IC1.26 | v54.7,33.1 54.5,33.1 54.3,33.3 53.8,33.3 FPGA.57
  Bottom 0.152: v58.6,25.3 58.6,29.2 v54.7,33.1
D2C  (via drill 0.3)
  Top 0.152: v60.1,34.5 59.9,34.7 59.9,35.6 60.2,35.9 60.2,36.5 IC2.37 | v57.9,36.6 55,39.5 53.9,39.5 53.8,39.4 FPGA.69
  Route15 0.152: v60.1,34.5 58,36.6 v57.9,36.6
D2D  (via drill 0.3)
  Top 0.152: v58.6,42.6 58.9,42.3 59.5,42.3 IC2.26 | v48.5,44.9 47.8,44.2 47.8,42.9 FPGA.81
  Bottom 0.152: v58.6,42.6 56.7,42.6 54.4,44.9 v48.5,44.9
D3A  (via drill 0.3)
  Top 0.152: v60.1,18.6 60.3,18.6 60.7,19 60.7,19.5 IC1.38 | v54.7,26.8 53.8,26.8 FPGA.44
  Route15 0.152: v60.1,18.6 59.7,18.6 55.9,22.4 55.9,25.6 v54.7,26.8
D3B  (via drill 0.3)
  Top 0.152: v57.9,25.7 57.9,25.2 58.4,24.7 59.5,24.7 IC1.27 | v52.7,32.9 53.7,32.9 FPGA.56
  Bottom 0.152: v57.9,25.7 57.9,27.5 52.7,32.7 v52.7,32.9
D3C  (via drill 0.3)
  Top 0.152: v60.9,34.5 60.3,35.1 60.3,35.5 60.7,35.9 60.7,36.5 IC2.38 | v55.9,36.6 55.9,36.8 54.9,37.8 53.8,37.8 FPGA.66
  Route15 0.152: v60.9,34.5 60.7,34.3 60.7,34.2 60.3,33.8 58.7,33.8 v55.9,36.6
D3D  (via drill 0.3)
  Top 0.152: v58.6,41.8 59.5,41.8 IC2.27 | v49.2,41.9 48.8,42.3 48.8,42.8 FPGA.79
  Bottom 0.152: v58.6,41.8 58.6,40.3 58,39.7 51.4,39.7 v49.2,41.9
D4A  (via drill 0.3)
  Top 0.152: v60.9,18.4 60.9,18.6 61.2,18.9 61.2,19.5 IC1.39 | v52.7,25.9 53.1,26.3 53.7,26.3 FPGA.43
  Route15 0.152: v60.9,18.4 60.7,18.4 60.3,18 59.8,18 52.7,25.1 v52.7,25.9
D4B  (via drill 0.3)
  Top 0.152: v57.3,27.2 57.3,25.3 58.3,24.3 59.5,24.3 IC1.28 | v52,32.5 52.3,32.5 52.5,32.3 53.7,32.3 FPGA.55
  Bottom 0.152: v52,32.5 v57.3,27.2
D4C  (via drill 0.3)
  Top 0.152: v60.9,35.3 60.9,35.6 61.2,35.9 61.2,36.5 IC2.39 | v54.7,37.2 54.4,37.2 54.3,37.3 53.8,37.3 FPGA.65
  Route15 0.152: v60.9,35.3 60,35.3 58.1,37.2 v54.7,37.2
D4D  (via drill 0.3)
  Top 0.152: v57.8,41.6 58.2,41.2 59.5,41.2 IC2.28 | v49.6,43.9 49.3,43.6 49.3,42.9 FPGA.78
  Bottom 0.152: v57.8,41.6 57.2,41.6 54.3,44.5 50.2,44.5 v49.6,43.9
D5A  (via drill 0.3)
  Top 0.152: v61.7,18.6 61.7,19.5 IC1.40 | v54.7,25 54.4,25.3 53.8,25.3 FPGA.41
  Bottom 0.152: v61.7,18.6 58.9,21.4 58.9,21.5 57.2,23.2 55.8,23.2 54.7,24.3 v54.7,25
D5B  (via drill 0.3)
  Top 0.152: v56.7,29.9 56.7,25.4 58.3,23.8 59.5,23.8 IC1.29 | v55.6,31.4 55,32 53.9,32 53.8,31.9 FPGA.54
  Route15 0.152: v56.7,29.9 56.7,30.3 v55.6,31.4
D5C  (via drill 0.3)
  Top 0.152: v61.7,35.6 61.7,36.5 IC2.40 | v52.7,37.4 53.2,36.9 53.7,36.9 FPGA.64
  Route15 0.152: v61.7,35.6 61.7,34.9 62.1,34.5 62.6,34.5 63.5,35.4 63.5,35.8 61.1,38.2 53.5,38.2 v52.7,37.4
D5D  (via drill 0.3)
  Top 0.152: v56.1,40.9 58,40.9 58.1,40.8 59.5,40.8 IC2.29 | v50.2,41.9 49.8,42.3 49.8,42.8 FPGA.77
  Bottom 0.152: v56.1,40.9 51.2,40.9 v50.2,41.9
D6A  (via drill 0.3)
  Top 0.152: v58.8,18.1 59.1,17.8 61.7,17.8 62.3,18.4 62.3,19.5 IC1.41 | v52.7,24.2 53,24.2 53.1,24.3 53.7,24.3 FPGA.39
  Route15 0.152: v52.7,24.2 v58.8,18.1
D6B  (via drill 0.3)
  Top 0.152: v57.1,24.2 58,23.3 59.5,23.3 IC1.30 | v52.7,30.9 53.7,30.9 FPGA.52
  Bottom 0.152: v57.1,24.2 57.1,26.5 v52.7,30.9
D6C  (via drill 0.3)
  Top 0.152: v62.3,35.1 62.3,36.5 IC2.41 | v54.7,35.6 54.5,35.6 54.3,35.8 53.8,35.8 FPGA.62
  Route15 0.152: v62.3,35.1 62.3,35.8 60.3,37.8 54.5,37.8 54.1,37.4 54.1,36.2 v54.7,35.6
D6D  (via drill 0.3)
  Top 0.152: v57.8,40.3 59.5,40.3 IC2.30 | v50.4,43.9 50.4,43.6 50.3,43.5 50.3,42.9 FPGA.76
  Bottom 0.152: v57.8,40.3 57.8,40.5 54.4,43.9 v50.4,43.9
D7A  (via drill 0.3)
  Top 0.152: v62.9,18.6 62.8,18.7 62.8,19.5 IC1.42 | v55.3,24.5 55,24.5 54.4,23.9 53.8,23.9 FPGA.38
  Bottom 0.152: v62.9,18.6 62.5,18.6 57.5,23.6 56.2,23.6 v55.3,24.5
D7B
  Top 0.152: IC1.31 59.5,22.8 57.7,22.8 56.3,24.2 56.3,27.8 54.3,29.8 53.8,29.8 FPGA.50
D7C  (via drill 0.3)
  Top 0.152: v62.9,35.6 62.8,35.7 62.8,36.5 IC2.42 | v57.7,35.6 57,35.6 56.3,34.9 53.8,34.9 FPGA.60
  Bottom 0.152: v62.9,35.6 62.6,35.6 62,36.2 58.3,36.2 v57.7,35.6
D7D  (via drill 0.3)
  Top 0.152: v58.6,39.5 58.8,39.7 59.5,39.7 IC2.31 | v54.2,42.3 53.3,42.3 51.9,43.7 51,43.7 50.8,43.5 50.8,42.9 FPGA.75
  Route15 0.152: v58.6,39.5 56.7,39.5 54.2,42 v54.2,42.3
DMINUS  (via drill 0.3)
  Top 0.152: v15.8,59 15.8,57.9 USB1.2 | v15.8,55.9 15.8,55.4 U340G.6
  Route15 0.152: v15.8,55.9 v15.8,59
DPLUS  (via drill 0.3)
  Top 0.152: v15.1,59.4 USB1.3 | v15.7,53.5 15.7,54 16.3,54.6 U340G.5
  Route15 0.152: v15.1,59.4 15.1,54.1 v15.7,53.5
E_20_A6  (via drill 0.3)
  Top 0.152: v6.8,26 5.6,26 IOEXPAND_0X20_BOT.27 | v31.3,9.9 31.3,8.6 31.5,8.4 PIN_ANALOG_IOEXP.1
  Route15 0.152: v6.8,26 9.9,26 14.9,31 15.3,31 23.9,22.4 23.9,16.3 v25.2,15
  Bottom 0.152: v25.2,15 26.2,15 v31.3,9.9
E_20_A7  (via drill 0.3)
  Top 0.152: v6.2,24.6 5.6,25.2 IOEXPAND_0X20_BOT.28 | v32.9,8.5 33.9,8.5 34,8.4 PIN_ANALOG_IOEXP.3
  Route15 0.152: v13.7,18.3 16.9,15.1 16.9,10.7 17.3,10.3 23.6,10.3 v24.6,11.3
  Bottom 0.152: v6.2,24.6 7.4,24.6 v13.7,18.3 | v24.6,11.3 28.6,11.3 31.4,8.5 v32.9,8.5
E_20_B6  (via drill 0.3)
  Top 0.152: v15.1,26.4 14.5,27 14.5,28.2 13.6,29.1 12.9,29.1 IOEXPAND_0X20_BOT.7 | v35.4,8.8 36.1,8.8 36.5,8.4 PIN_ANALOG_IOEXP.5
  Route15 0.152: v15.1,26.4 16.8,26.4 17.4,27 17.8,27 23.5,21.3 23.5,15.9 v25.3,14.1
  Bottom 0.152: v25.3,14.1 26.3,14.1 31.3,9.1 35.1,9.1 v35.4,8.8
E_20_B7  (via drill 0.3)
  Top 0.152: v21.4,7.4 7.3,7.4 4.5,10.2 4.5,13.6 7.4,16.5 7.4,26 11.2,29.8 12.8,29.8 IOEXPAND_0X20_BOT.8 | v30.8,6.3 37.1,6.3 39.1,8.3 PIN_ANALOG_IOEXP.7
  Route15 0.152: v21.4,7.4 21.8,7.4 25,4.2 28.7,4.2 v30.8,6.3
E_ACSW1
  Top 0.152: ACR1.1 10.2,21.9 10.2,22.6 12.8,25.2 IOEXPAND_0X20_BOT.1
E_ACSW2
  Top 0.152: ACR2.1 10.1,19.7 10.1,20.2 9.2,21.1 9.2,23 12.1,25.9 12.8,25.9 IOEXPAND_0X20_BOT.2
E_ACSW3
  Top 0.152: ACR3.1 10.1,17.4 10.1,18 8.8,19.3 8.8,23.2 12.1,26.5 12.8,26.5 IOEXPAND_0X20_BOT.3
E_ACSW4
  Top 0.152: ACR4.1 10.1,15.2 10.1,15.7 8.2,17.6 8.2,23.3 12.1,27.2 12.8,27.2 IOEXPAND_0X20_BOT.4
E_GSW1  (via drill 0.3)
  Top 0.152: v35.7,1.7 37.7,3.7 37.7,4.2 38.7,5.2 48.1,5.2 50.2,7.3 55.3,7.3 56.6,6 71.7,6 72.9,7.2 72.9,7.5 GAINSW1.6 | v6.8,29.9 5.6,29.9 IOEXPAND_0X20_BOT.21
  Route15 0.152: v35.7,1.7 27.6,1.7 27.1,1.2 10.6,1.2 5.2,6.6 5.2,28.3 v6.8,29.9
E_GSW2  (via drill 0.3)
  Top 0.152: GAINSW2.6 75.1,20.1 v75.7,20.7 | v4.3,28.6 4.8,29.1 5.5,29.1 IOEXPAND_0X20_BOT.22
  Route15 0.152: v75.7,20.7 75.7,17 75.8,16.9 75.8,15.1 74.6,13.9 v70.9,13.9 | v66.7,9.7 64.1,9.7 57.1,2.7 v40.1,2.7
  Bottom 0.152: v66.7,9.7 v70.9,13.9 | v40.1,2.7 21.2,2.7 21.1,2.8 20.7,2.8 20.5,2.6 9.5,2.6 0.9,11.2 0.9,27.9 1.6,28.6 v4.3,28.6
E_GSW3  (via drill 0.3)
  Top 0.152: v75.4,40.9 74.9,40.4 74.9,39.9 GAINSW3.6 | v6.8,29.1 6.3,28.6 5.6,28.6 IOEXPAND_0X20_BOT.23
  Route15 0.152: v75.4,40.9 75.4,46.1 76.6,47.3 76.6,50.1 74.2,52.5 v67.2,52.5 | v19.9,42.2 v26.6,48.9 | v19.9,32.7 19.6,32.7 19.4,32.5 15.8,32.5 15.3,33 10.7,33 v6.8,29.1
  Bottom 0.152: v67.2,52.5 66.8,52.5 64.2,49.9 53.5,49.9 48,55.4 48,58.7 47.3,59.4 36.2,59.4 35.3,58.5 35.3,56.3 27.9,48.9 v26.6,48.9 | v19.9,32.7 v19.9,42.2
E_GSW4  (via drill 0.3)
  Top 0.152: v74,51.9 GAINSW4.6 | v9.6,31.1 9.4,31.1 7.4,29.1 7.4,28.9 6.9,28.4 6.8,28.4 6.2,27.8 5.6,27.8 IOEXPAND_0X20_BOT.24
  Route15 0.152: v74,51.9 72.1,51.9 68.6,48.4 68.6,41.6 68.2,41.2 67.8,41.2 64.6,44.4 64.6,46.2 59.9,50.9 57.8,50.9 54.2,54.5 53.8,54.5 50.3,58 50.3,58.7 49.8,59.2 30.8,59.2 v29.6,58 | v23.6,52 23.6,51.6 10.8,38.8 10.8,36.8 9.9,35.9 v9.6,35.9
  Bottom 0.152: v23.6,52 v29.6,58 | v9.6,31.1 v9.6,35.9
E_OVSAMP1  (via drill 0.3)
  Top 0.152: v74,31.1 74,30.1 OVSAMP1.6 | v4.3,42.1 4.3,35.8 2.2,33.7 1.6,33.7 0.9,33 0.9,29.6 1.9,28.6 3.5,28.6 4.8,27.3 5.5,27.3 IOEXPAND_0X20_BOT.25
  Route15 0.152: v68.6,50.3 58.9,60 55.6,60 54.7,60.9 25.4,60.9 23.6,59.1 16.5,59.1 15.6,60 13.2,60 4.3,51.1 v4.3,42.1
  Bottom 0.152: v74,31.1 74,31.6 71.8,33.8 70.1,33.8 68.6,35.3 v68.6,50.3
E_OVSAMP2  (via drill 0.3)
  Top 0.152: v70.2,31.1 70.2,30.1 OVSAMP2.6 | v4.3,27 4.5,27 4.9,26.6 5.5,26.6 IOEXPAND_0X20_BOT.26
  Route15 0.152: v23.6,58.2 21.2,58.2 4.1,41.1 1.6,41.1 1.1,40.6 1.1,29.6 2.3,28.4 2.9,28.4 v4.3,27
  Bottom 0.152: v70.2,31.1 70.2,31.7 66.8,35.1 66.8,50.5 70.1,53.8 70.1,54.2 65.8,58.5 59.8,58.5 59.6,58.7 56.9,58.7 54.7,60.9 26.3,60.9 v23.6,58.2
E_SHDN1  (via drill 0.3)
  Top 0.152: v67.4,23.3 66.5,23.3 IC1.7 | v22.8,11.7 22.8,14.9 22.7,15 22.7,15.6 23.2,16.1 23.2,22 20.2,25 18.2,25 17.2,24 16.3,24 13.9,26.4 13.9,27.5 13.6,27.8 12.9,27.8 IOEXPAND_0X20_BOT.5
  Route15 0.152: v67.4,23.3 67.4,22.1 66.2,20.9 66.2,18.4 v59.4,11.6 | v50,11.6 40.8,11.6 v37.7,8.5
  Bottom 0.152: v50,11.6 v59.4,11.6 | v37.7,8.5 35.9,8.5 35.3,7.9 26.6,7.9 v22.8,11.7
E_SHDN2  (via drill 0.3)
  Top 0.152: v68,41.8 68,41.3 67,40.3 66.5,40.3 IC2.7 | v11.4,29.2 12,28.6 12.8,28.6 IOEXPAND_0X20_BOT.6
  Route15 0.152: v68,41.8 68,43.3 60,51.3 58.9,51.3 55,55.2 55,55.7 54.2,56.5 53,56.5 49.9,59.6 25.8,59.6 20.3,54.1 19.4,54.1 10.2,44.9 v10.2,37 | v11.4,29.2 v10.2,30.4
  Bottom 0.152: v10.2,30.4 v10.2,37
E_SUPER1  (via drill 0.3)
  Top 0.152: v25.3,25.2 23.7,25.2 IOEXPAND_0X24_TOP.1
  Route15 0.152: v13.1,10.9 11.7,10.9 8.6,7.8 7.5,7.8 7.1,7.4 7.1,5.2 10.7,1.6 27,1.6 27.9,2.5 38.8,2.5 40.8,0.5 73.9,0.5 74.8,1.4 SSUPER1.1
  Bottom 0.152: v25.3,25.2 25.3,23.8 23,21.5 23,20.4 13.5,10.9 v13.1,10.9
E_SUPER2  (via drill 0.3)
  Top 0.152: v24.9,25.9 23.7,25.9 IOEXPAND_0X24_TOP.2
  Route2 0.152: v30.7,22.8 v28.7,24.8
  Route15 0.152: v24.9,25.9 27.6,25.9 v28.7,24.8 | v44.5,23.8 48,23.8 v52.3,19.5
  Bottom 0.152: v30.7,22.8 33.1,22.8 34.1,21.8 38.5,21.8 40.5,23.8 v44.5,23.8 | v52.3,19.5 58.3,19.5 60,17.8 65.6,17.8 69.6,21.8 69.6,28 70.2,28.6 73.4,28.6 75.6,26.4 75.6,25.2 SSUPER2.1
E_SUPER3  (via drill 0.3)
  Top 0.152: v25.6,26.5 23.7,26.5 IOEXPAND_0X24_TOP.3
  Route2 0.152: v31,27.5 31.9,27.5 33.1,26.3 v35.5,26.3
  Route15 0.152: v25.6,26.5 30,26.5 v31,27.5 | v58.3,45.1 61.4,45.1 v70.7,35.8
  Bottom 0.152: v35.5,26.3 35.5,29.9 47.9,42.3 47.9,45.1 48.3,45.5 57.9,45.5 v58.3,45.1 | v70.7,35.8 74.5,35.8 75.5,34.8 SSUPER3.1
E_SUPER4  (via drill 0.3)
  Top 0.152: v24.9,27.2 23.7,27.2 IOEXPAND_0X24_TOP.4
  Route15 0.152: v28.5,31 28.2,31 27.6,31.6 27,31.6 26.1,32.5 26.1,32.6 25.5,33.2 v25.3,33.2
  Bottom 0.152: v24.9,27.2 25.1,27.2 26.8,28.9 27.8,28.9 28.5,29.6 v28.5,31 | v25.3,33.2 25.3,45.5 23,47.8 23,58.4 26.1,61.5 72.6,61.5 74.8,59.3 74.8,58.1 SSUPER4.1
E_TERM1  (via drill 0.3)
  Top 0.152: v27.5,23.2 26.3,24.4 26.3,26.6 25.1,27.8 23.7,27.8 IOEXPAND_0X24_TOP.5
  Route2 0.152: v31.1,19.6 v27.5,23.2
  Route15 0.152: v40,11.7 40.4,11.7 40.9,12.2 50.2,12.2 v51.4,11
  Bottom 0.152: v31.1,19.6 28.9,17.4 28.9,14.2 31.4,11.7 v40,11.7 | v51.4,11 51.4,10.2 52.6,9 59.4,9 59.5,9.1 63.4,9.1 70.1,2.4 84.8,2.4 85.7,1.5 ST1.6
E_TERM2  (via drill 0.3)
  Top 0.152: v28.7,24 28.1,24.6 28.1,25.8 28.5,26.2 28.5,28.4 28.3,28.6 23.7,28.6 IOEXPAND_0X24_TOP.6
  Route2 0.152: v32.8,19.9 v28.7,24
  Route15 0.152: v58.3,2.7 58.6,2.7 65,9.1 71.7,9.1 84.1,21.5 84.1,23.6 85.6,25.1 86,25.1 ST2.6
  Bottom 0.152: v32.8,19.9 35.8,19.9 37.6,18.1 39.4,18.1 41.2,16.3 41.2,6.1 43.1,4.2 43.1,3.7 44.4,2.4 51.6,2.4 52.2,3 54.1,3 54.6,2.5 58.1,2.5 v58.3,2.7
E_TERM3  (via drill 0.3)
  Top 0.152: v28.7,33.6 28.7,32.3 27.8,31.4 27.2,31.4 25,29.2 23.7,29.2 IOEXPAND_0X24_TOP.7
  Route15 0.152: v59.7,44.5 59.7,44.3 70.2,33.8 77.2,33.8 79,35.6 85.1,35.6 85.9,34.8 ST3.6
  Bottom 0.152: v28.7,33.6 29.5,33.6 30.1,34.2 32.6,34.2 33.3,33.5 34.1,33.5 35.9,31.7 36.3,31.7 45.4,40.8 45.4,43.6 45.3,43.7 45.3,44.4 45.4,44.5 45.4,45 43.6,46.8 43.6,48.3 43.9,48.6 49.8,48.6 50.5,47.9 56.3,47.9 v59.7,44.5
E_TERM4  (via drill 0.3)
  Top 0.152: v25.5,32.4 25.5,30.9 24.5,29.9 23.7,29.9 IOEXPAND_0X24_TOP.8
  Route15 0.152: v69.5,54 81.7,54 85.7,58 ST4.6
  Bottom 0.152: v25.5,32.4 25.5,32.6 25.9,33 25.9,45.4 25.6,45.7 25.6,50.7 33,58.1 33,58.7 34.1,59.8 49.9,59.8 53.1,56.6 53.1,55 53.7,54.4 55.6,54.4 57.5,52.5 62.4,52.5 63.9,54 v69.5,54
GND  (via drill 0.3)
  Top 0.305: RLED5.2 15.4,15.2 15.4,17.5 RLED6.2 15.4,17.6 15.4,19.6 RLED7.2 15.4,19.7 15.4,22 RLED8.2 15.4,22.1 v15.4,23.3 | RLED1.2 19.6,15.3 19.6,17.5 RLED2.2 19.6,17.6 19.6,19.6 RLED3.2 19.6,19.8 19.6,22 RLED4.2 19.6,22.1 v19.6,23.3 | C-AIN3.2 CREF2.2 71.3,41 73.6,41 v73.8,40.9 73.75,40.95 | C-AIN2.2 71.1,20.8 CREF1.2 71.1,20.7 71.1,19.6 | C-AIN4.2 CADD2_B.2 v70.2,47.3 | CADD2_A.2 CADD1_B.2 v63.6,33.8 | DAC1.4 83.5,32 84,32.5 COFFSET.1 v86.6,32.5 | C0DD2_A.2 CODD1_B.2 v61.6,33.8 | RS6.1 28.3,4.4 28.3,2.3 RJ2.2 28.3,2.2 v28.3,1 | C_OSC2.2 4.8,51.6 | 4.8,51.6 C_OSC1.2 | v63.3,27.5 63.3,26.5 IC1.18 | 63.8,26.5 63.8,27.9 v63.9,28 | 63.8,26.5 IC1.17 | 63.8,26.5 IC1.16 | v63.3,44.5 63.3,43.5 IC2.18 | 63.8,43.5 63.8,44.9 v63.9,45 | 63.8,43.5 IC2.17 63.8,43.4 63.8,42.1 63.9,42 63.9,40.1 63.8,40 IC2.EP_GND | 63.8,43.5 IC2.16 IC2.18 | v48.9,20.2 48.9,19.3 OSC.2 | v72,11.9 GAINSW1.2 | v73.9,21.7 GAINSW2.2 | v69.3,31.7 OVSAMP2.2 | v73.1,31.7 OVSAMP1.2 | GAINSW3.2 73.9,41.1 73.75,40.95 | 73.7,40.9 73.75,40.95 | v72.2,55.5 GAINSW4.2 | v33.3,24.4 32.3,24.4 FPGA.142 | v35.7,22.4 35.7,21.4 FPGA.4 | v36.2,20.3 36.2,21.3 FPGA.5 | v33.3,26.9 32.3,26.9 FPGA.137 | v33.3,28.9 32.3,28.9 FPGA.133 | v33.3,32.9 32.3,32.9 FPGA.125 | v33.3,37.4 32.3,37.4 FPGA.116 | v36.2,43.9 36.2,42.9 FPGA.104 | v54.8,25.9 53.8,25.9 FPGA.42 | v54.8,31.4 53.8,31.4 FPGA.53 | v40.7,43.9 40.7,42.9 FPGA.95 | v54.8,36.4 53.8,36.4 FPGA.63 | v46.7,43.9 46.7,42.9 FPGA.83 | v54.8,38.9 53.8,38.9 FPGA.68 | v78.2,29.5 78.2,30.1 78.6,30.5 DAC1.10 | v50.4,20.1 50.4,19.1 C_OSC.2 | v13.8,59.1 USB1.5 | v4.3,32.4 5.5,32.4 IOEXPAND_0X20_BOT.17 | v6.8,33.1 5.6,33.1 IOEXPAND_0X20_BOT.16
  Top 0.305: v4.3,33.7 5.5,33.7 IOEXPAND_0X20_BOT.15 | v14.1,31.1 12.9,31.1 IOEXPAND_0X20_BOT.10 | v15.1,32.4 16.3,32.4 IOEXPAND_0X24_TOP.17 | v17.7,33.1 16.4,33.1 IOEXPAND_0X24_TOP.16 | v24.9,31.1 23.7,31.1 IOEXPAND_0X24_TOP.10 | v23.6,59.9 24.9,59.9 RLEDPOW.2 | v87.6,8.7 87.6,10 RIN5.2 | v87.6,21.5 87.6,20.2 RIN6.2 | v95.2,15.8 96.5,15.8 R10M_1.1 | v87.6,43.2 87.6,41.9 RIN7.2 | v87.7,53.8 87.7,52.5 RIN8.2 | v95.1,48.6 96.4,48.6 R10M_4.1 | v21.4,53.4 21.4,54.6 U340G.1 | v5.8,51.6 4.8,51.6 | v55.7,15.8 C0DD1_A.2 | v75.2,15.3 C5VOPAMP1.2 | v55.7,47.3 C0DD2_B.2 | v75.2,47.5 C5VOPAMP2.2 | 79.8,14.1 79.8,12.5 U1.4 79.8,12.3 79.8,11.3 v79.3,10.8 | v80.1,43 79.9,43.2 79.9,44.5 U2.4 | v41.8,48 41.8,49.4 PIN_AIN_IO2_PWRGND.8 | v44.3,51 44.3,49.5 PIN_AIN_IO2_PWRGND.6 | v49.4,56.8 49.4,55.4 PIN_AIN_IO2_PWRGND.1 | 71.2,19.5 71.1,19.6 | v55.7,11 54.1,11 REG1.1 | v56.2,54.8 57.8,54.8 REG.1 | v70.1,15.4 CADD1_A.2 70.1,18.7 C-AIN1.2 70.2,18.7 71.1,19.6 | v40.5,32.1 42.9,32.1 FPGA.E | IC1.EP_GND 63.8,23 63.9,23.1 63.9,25 63.8,25.1 63.8,26.4 IC1.17 | IC2.5 66.45,39.3 65.97,39.3 65.27,40 IC2.EP_GND | IC2.18 63.25,40.25 IC2.EP_GND | IC1.18 63.25,23.25 IC1.EP_GND | IC1.18 IC1.17 | IC1.5 66.45,22.3 65.97,22.3 65.27,23 IC1.EP_GND | v59.8,1.4 59.7,1.5 58.8,1.5 SW_RESET.P$2
  Bottom 0.305: CV12.2 48,49.7 49.4,49.7 49.7,49.4 CP6.2 v52.5,49.4 | COFFSETB10.1 82.1,40 82.2,39.9 82.2,39.1 82.3,39 COFFSETA2.1 84.7,39 v84.9,38.8 | COFFSETB8.1 81.9,22.3 82,22.4 82,22.9 82.1,23 COFFSETA1.1 84.3,23 v84.7,23.4 | CP2.2 CP1.2 v62.4,53.4 | R50-11.2 94,40.8 94,38.6 R50-10.2 94,38.5 94,37.8 v94.5,37.3 | R50-9.2 89.8,38.6 89.8,40.8 R50-12.2 89.8,40.9 v89.8,42.1 | R50-8.2 94.1,21.6 94.1,23.8 R50-6.2 94.1,23.9 94.1,24.7 v94.5,25.1 | R50-5.2 89.7,21.6 89.7,23.8 R50-7.2 89.7,23.9 v89.7,25.1 | R50-15.2 94,54.6 94,56.7 R50-16.2 94,56.8 94,57.5 v94.5,58 | R50-14.2 89.8,54.6 89.8,56.7 R50-13.2 89.8,56.8 v89.8,58 | R50-4.2 94.2,5.5 94.2,7.6 R50-3.2 94.2,7.7 94.2,8.8 v94.3,8.9 | R50-1.2 90,5.5 90,7.6 R50-2.2 90,7.7 v90,8.9 | v52.8,1.1 C_5V_10NF1.1 | v59,60.6 C_5V_10NF.1 | v89.9,10.7 91,10.7 K1.2 | v89.9,15.7 91,15.7 K2.2 | v89.9,43.7 91,43.7 K3.2 | v89.9,48.7 91,48.7 K4.2 | v95.2,13.8 95.3,13.9 96.5,13.9 R10M_2.1 | v95.1,48.6 96.4,48.6 R10M_4.1 | v35.3,15.2 34.1,15.2 CG13.2 | v39,15.7 38.5,15.2 37.7,15.2 CG15.2 | v54.2,1.4 CP10.1 | v55.9,9.9 CP7.2 | v58.8,10.2 CP8.2 | v79.3,8 COFFSETB6.1 | v43.2,49.6 44.6,49.6 CV11.2 | v63.1,59.4 CP11.1 | v79.6,54.6 COFFSETB12.1 | v29.5,14.4 CG14.2 | v52,10.4 CP3.2 | v84.3,9.5 COFFSETA6.1 | v65.8,52.3 64.3,52.3 CP5.2 | v84.4,55.4 COFFSETA3.1 | v65.8,3.7 CP9.2 63.7,3.7 63.6,3.6 63.6,2.7 63.5,2.6 CP4.2
  pour Route2: -3,-1 -3,65 99,65 99,-1
INA1  (via drill 0.3)
  Top 0.152: v67.4,21.2 66.5,21.2 IC1.3 | v68.8,9.7 71,7.5 GAINSW1.4 | v72.1,31.7 72.1,32.6 OVSAMP1.3 | v75.1,13.3 75.9,12.5 U1.1
  Route15 0.152: 67.4,13.3 67.4,11.1 v68.8,9.7 | 67.4,13.3 v67.4,21.2 | 67.4,13.3 v75.1,13.3
  Bottom 0.152: v72.1,31.7 72.1,31 68,26.9 68,21.8 v67.4,21.2
INA2  (via drill 0.3)
  Top 0.152: 73.75,38.85 73,39.6 73,39.9 GAINSW3.4 | 73.75,38.85 74,38.6 74,32.7 OVSAMP1.1 | v74.7,44.3 75.2,44.8 76,44.8 U2.1 | v73.8,38.9 73.75,38.85
  Route2 0.152: v74.7,44.3 73.2,42.8 73.2,39.5 v73.8,38.9
INA12  (via drill 0.3)
  Top 0.152: v67.4,38.3 66.5,38.3 IC2.3 | v71,31.4 71,31.2 72.1,30.1 OVSAMP1.4
  Bottom 0.152: v67.4,38.3 67.4,35 v71,31.4
INA-1
  Top 0.152: 67.95,19.75 68,19.7 68,18.8 C-AIN1.1 | 67.95,19.75 67,20.7 66.5,20.7 IC1.2 | IC1.4 66.5,21.8 67.6,21.8 68,21.4 68,19.8 67.95,19.75
INA-2
  Top 0.152: IC2.2 66.5,37.7 67.6,37.7 69.2,39.3 C-AIN3.1 68.7,38.9 67.2,38.9 67.1,38.8 66.5,38.8 IC2.4
INAMINUS1  (via drill 0.3)
  Top 0.152: 81,9.9 CH1.+ | 81,9.9 CL1.+ | 81,9.9 83,11.9 RIN1.2 | CL1.+ 77.55,10.75 | 77.55,10.75 77.3,11 77.3,12.4 U1.2 | CL1.+ | v77.7,10.9 77.55,10.75
  Bottom 0.152: 72.9,11 72.9,8.6 | 75.8,8.2 73.3,8.2 72.9,8.6 | 72.9,8.6 CIN56_1.2 | 77.7,9.8 77.4,9.8 75.8,8.2 | 77.7,9.8 78,9.8 CGAIN1_1.1 77.7,9.8 | 75.8,8.2 CIN5_1.1 | 72.9,11 73.9,12 73.9,13.6 RIN1_10K.2 74,13.6 74.3,13.9 76.7,13.9 | 72.9,11 CIN1NF_1.2 | 76.7,13.9 77.6,14.8 79.6,14.8 80.5,13.9 81,13.9 RGAIN1_1.2 | 76.7,13.9 RGAIN2_1.2 | 77.7,9.8 v77.7,10.9
INAMINUS2  (via drill 0.3)
  Top 0.152: RIN3.2 83,44.5 82.1,43.6 CH3.+ 82.1,42.7 80.6,42.7 80.3,42.4 79.7,42.4 v79.2,42.9 78.2,42.9 CL3.+ 78.1,44.1 77.4,44.8 U2.2
  Route15 0.152: v75.8,40.2 76.5,40.2 78.75,42.45 | v79.2,42.9 78.75,42.45 | v78.7,47.5 78.7,42.5 78.75,42.45
  Bottom 0.152: CIN1NF_3.2 73.6,44.1 73.6,46.3 73.7,46.4 RIN3_10K.2 76,46.4 | 78.7,47.3 76.9,47.3 76,46.4 | 78.7,47.3 79,47.3 79.9,46.4 80.4,46.4 RGAIN1_3.2 | 76,46.4 RGAIN2_3.2 | CIN5_3.1 76.9,40.2 v75.8,40.2 75.3,40.2 73.6,41.9 CIN56_3.2 | CGAIN1_3.1 79.1,42.8 v79.2,42.9 | v78.7,47.5 78.7,47.3
INB1  (via drill 0.3)
  Top 0.152: v67.4,24.2 66.5,24.2 IC1.9 | v68.3,31.7 68.3,32.6 OVSAMP2.3 | v72.9,21.4 72.9,20.1 GAINSW2.4 | v75.2,16.7 75.2,16.5 75.6,16.1 76.4,16.1 77.2,16.9 77.2,17.3 U1.7
  Route15 0.152: 67.4,26.9 67.4,30.8 v68.3,31.7 | 67.4,26.9 v67.4,24.2 | 67.4,26.9 v72.9,21.4 72.9,20.2 75.2,17.9 v75.2,16.7
INB2  (via drill 0.3)
  Top 0.152: v69.5,35.3 69.5,34.4 70.2,33.7 70.2,32.7 OVSAMP2.1 | v69.5,50.2 71.2,51.9 GAINSW4.4 | v76,47.5 77.3,48.8 77.3,49.7 U2.7
  Route15 0.152: v76,47.5 75,48.5 v69.5,48.5
  Bottom 0.152: v69.5,50.2 v69.5,48.5 v69.5,35.3
INB12
  Top 0.152: IC2.9 66.5,41.3 67,41.3 67.4,41.7 67.4,42 68.2,42.8 69.9,42.8 70.1,42.6 70.1,38.2 67.7,35.8 67.7,30.7 68.3,30.1 OVSAMP2.4
INB-1
  Top 0.152: IC1.11 66.5,24.8 | 66.5,24.8 67.6,24.8 69.1,23.3 C-AIN2.1 | 66.5,24.8 IC1.10
INB-2
  Top 0.152: IC2.10 IC2.11 66.5,42.3 67,42.3 68.2,43.5 C-AIN4.1
INBMINUS1  (via drill 0.3)
  Top 0.152: 81.1,22.9 CH2.+ | 81.1,22.9 CL2.+ | 81.1,22.9 81.1,20.3 | 81.1,20.3 81.1,19.2 82.3,18 83,18 RIN2.2 | 81.1,20.3 80.05,19.25 | 80.05,19.25 78.6,17.8 78.6,17.4 U1.6 | v80,19.3 80.05,19.25
  Bottom 0.152: 73.4,20.1 73.4,20.4 CIN56_2.2 73.4,20.1 | 73.4,20.1 73.4,18.2 | 73.9,16.1 73.9,17.7 73.4,18.2 | 73.9,16.1 73.9,15.9 RIN2_10K.2 73.9,16.1 | 73.4,18.2 CIN1NF_2.2 | 73.9,16.1 76.7,16.1 RGAIN2_2.2 | 80,19.4 79.8,19.4 79.1,20.1 CGAIN1_2.1 79.1,20.2 76.9,20.2 CIN5_2.1 76.9,20.1 73.4,20.1 | 80,19.4 81.3,19.4 82,18.7 82,17.1 81,16.1 RGAIN1_2.2 | 80,19.4 v80,19.3
INBMINUS2  (via drill 0.3)
  Top 0.152: CL4.+ v79,55.6 CH4.+ 81.6,53.8 82.5,52.9 82.5,51.8 82,51.3 82,48.5 | v84,47.6 83,48.6 RIN4.2 83,48.5 82,48.5 | 82,48.5 79.5,48.5 78.7,49.3 78.7,49.7 U2.6
  Bottom 0.152: RGAIN2_4.2 76.1,48.6 RIN4_10K.2 73.7,48.6 73.7,50.4 73.2,50.9 | 73.2,52.6 73.2,53.1 CIN56_4.2 | 73.2,52.6 73.2,50.9 | 78.1,52.7 75.9,52.7 CIN5_4.1 75.9,52.6 73.2,52.6 | 73.2,50.9 CIN1NF_4.2 | v84,47.6 83,48.6 82.5,48.6 RGAIN1_4.2 | 78.1,52.7 78.1,52.9 79,53.8 v79,55.6 | 78.1,52.7 CGAIN1_4.1
INJ1
  Top 0.152: C_AC1.2 87.9,12.3 87.9,12.1 86.6,10.8 86.6,7.8 85.6,6.8 J1.SIGNAL
  Bottom 0.152: K1.3 85,7.3 85.5,6.8 J1.SIGNAL 85.5,6.7 83.2,4.4 ST1.2
INJ2  (via drill 0.3)
  Top 0.152: J2.SIGNAL 87.2,22.7 88.5,21.4 88.5,19.4 87.9,18.8 87.9,18 C_AC2.2
  Route15 0.152: 86.9,23 85.9,23 85.6,22.7 J2.SIGNAL | 86.9,23 86.9,25.5 84.8,27.6 83.5,27.6 ST2.2 | 86.9,23 v87,23
  Bottom 0.152: K2.3 85,16.7 87.1,18.8 87.1,21.2 87,21.3 v87,23
INJ3
  Top 0.152: C_AC3.2 87.9,44.3 86.6,43 86.6,40.7 85.6,39.7 J3.SIGNAL
  Route15 0.152: ST3.2 83.4,38.1 84.9,39.6 85.5,39.6 J3.SIGNAL
  Bottom 0.152: K3.3 85,40.2 85.5,39.7 J3.SIGNAL
INJ4
  Top 0.152: C_AC4.2 88,50.3 86.7,51.6 86.7,54.5 85.6,55.6 J4.SIGNAL
  Bottom 0.152: K4.3 85,49.9 85.9,50.8 85.9,55.3 85.6,55.6 J4.SIGNAL 85.5,55.7 85.5,57 83.2,59.3 ST4.2
IO_29  (via drill 0.3)
  Top 0.152: v35,40.5 39.7,35.8 39.7,31 40.8,29.9 41.6,29.9 48.2,23.3 48.2,21.4 FPGA.29
  Bottom 0.152: v35,40.5 34.7,40.5 PIN_IO_1.9
IO_100  (via drill 0.3)
  Top 0.152: v38.3,44.3 38.3,42.9 FPGA.100 | v35.3,54.6 34.9,54.6 34.2,55.3 PIN_AIN_IO2_PWRGND.13
  Route15 0.152: v38.3,44.3 38.3,45 38.2,45.1 38.2,51.7 v35.3,54.6
IO_101  (via drill 0.3)
  Top 0.152: v37.7,44.8 37.7,42.9 FPGA.101 | v32.8,54.6 32.4,54.6 31.7,55.3 PIN_AIN_IO2_PWRGND.15
  Route15 0.152: v37.7,44.8 37.7,46.4 37.8,46.5 37.8,49.6 v32.8,54.6
IO_110  (via drill 0.3)
  Top 0.152: v33.2,40.7 32.9,40.4 32.3,40.4 FPGA.110
  Bottom 0.152: v33.2,40.7 33.8,40.1 33.8,39.7 27.4,33.3 PIN_IO_1.3
IO_111  (via drill 0.3)
  Top 0.152: v33.2,39.9 32.3,39.9 FPGA.111
  Bottom 0.152: v33.2,39.9 28.4,35.1 PIN_IO_1.4
IO_113  (via drill 0.3)
  Top 0.152: v31.2,38.8 32.2,38.8 FPGA.113
  Route15 0.152: v31.2,38.8 28.5,38.8 27.4,37.7 PIN_IO_1.5
IO_114  (via drill 0.3)
  Top 0.152: v33.2,38.3 32.3,38.3 FPGA.114
  Route15 0.152: v33.2,38.3 33,38.3 31.2,40.1 27.4,40.1 PIN_IO_1.6
IO_118  (via drill 0.3)
  Top 0.152: v33.2,36.4 32.3,36.4 FPGA.118
  Route15 0.152: v33.2,36.4 33.9,37.1 33.9,38.4 29.6,42.7 PIN_IO_1.7
IO_119  (via drill 0.3)
  Top 0.152: v31.2,35.8 32.2,35.8 FPGA.119
  Bottom 0.152: v31.2,35.8 33.4,35.8 34.2,36.6 34.2,40.5 29.5,45.2 27.4,45.2 PIN_IO_1.8
IO_122  (via drill 0.3)
  Top 0.152: v33.2,34.4 32.3,34.4 FPGA.122
  Route15 0.152: v33.2,34.4 33.2,34.8 33,35 33,35.4 34.3,36.7 34.3,43.4 27.4,50.3 PIN_IO_1.10
IO_CLK_88  (via drill 0.3)
  Top 0.152: v44.2,44 44.2,42.9 FPGA.88 | v43.2,54.6 43.6,54.6 44.3,55.3 PIN_AIN_IO2_PWRGND.5
  Route15 0.152: v44.2,44 44.2,50.3 43.2,51.3 v43.2,54.6
IO_CLK_89  (via drill 0.3)
  Top 0.152: v43.4,44 43.7,43.7 43.7,42.9 FPGA.89 | v42.9,55.4 41.8,55.4 PIN_AIN_IO2_PWRGND.7